# EAGLE board 63-00013_Battery_PCB_6.3 (EAGLE 9.6.2), part 1 of 2
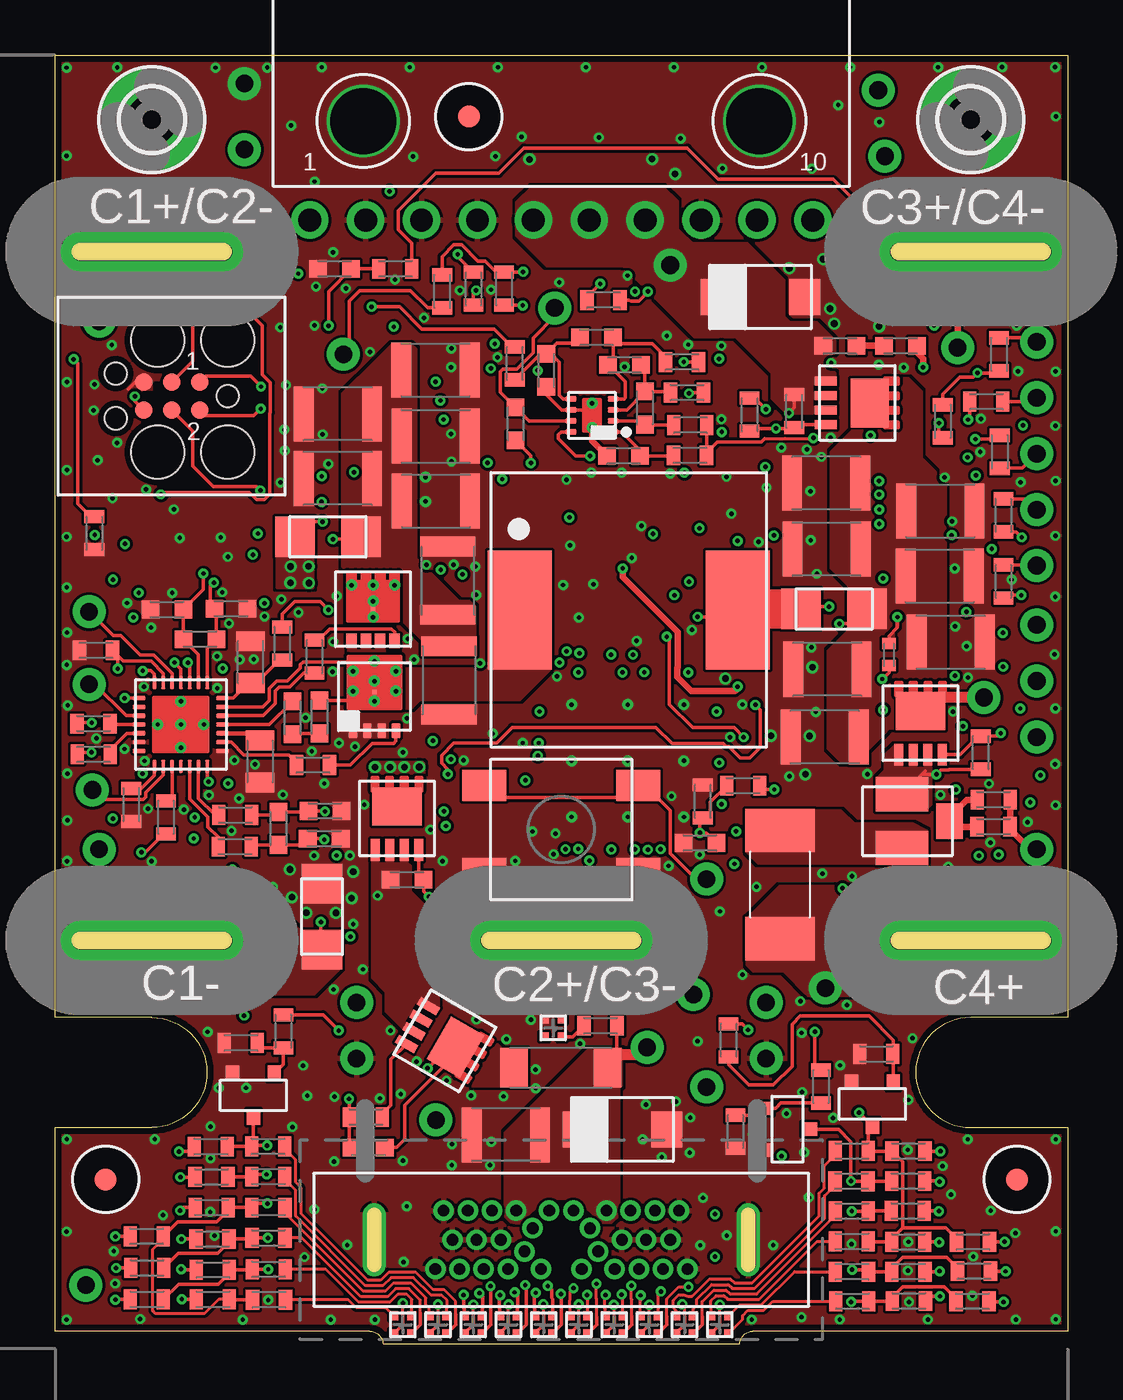
[diagram p8: board, top side]
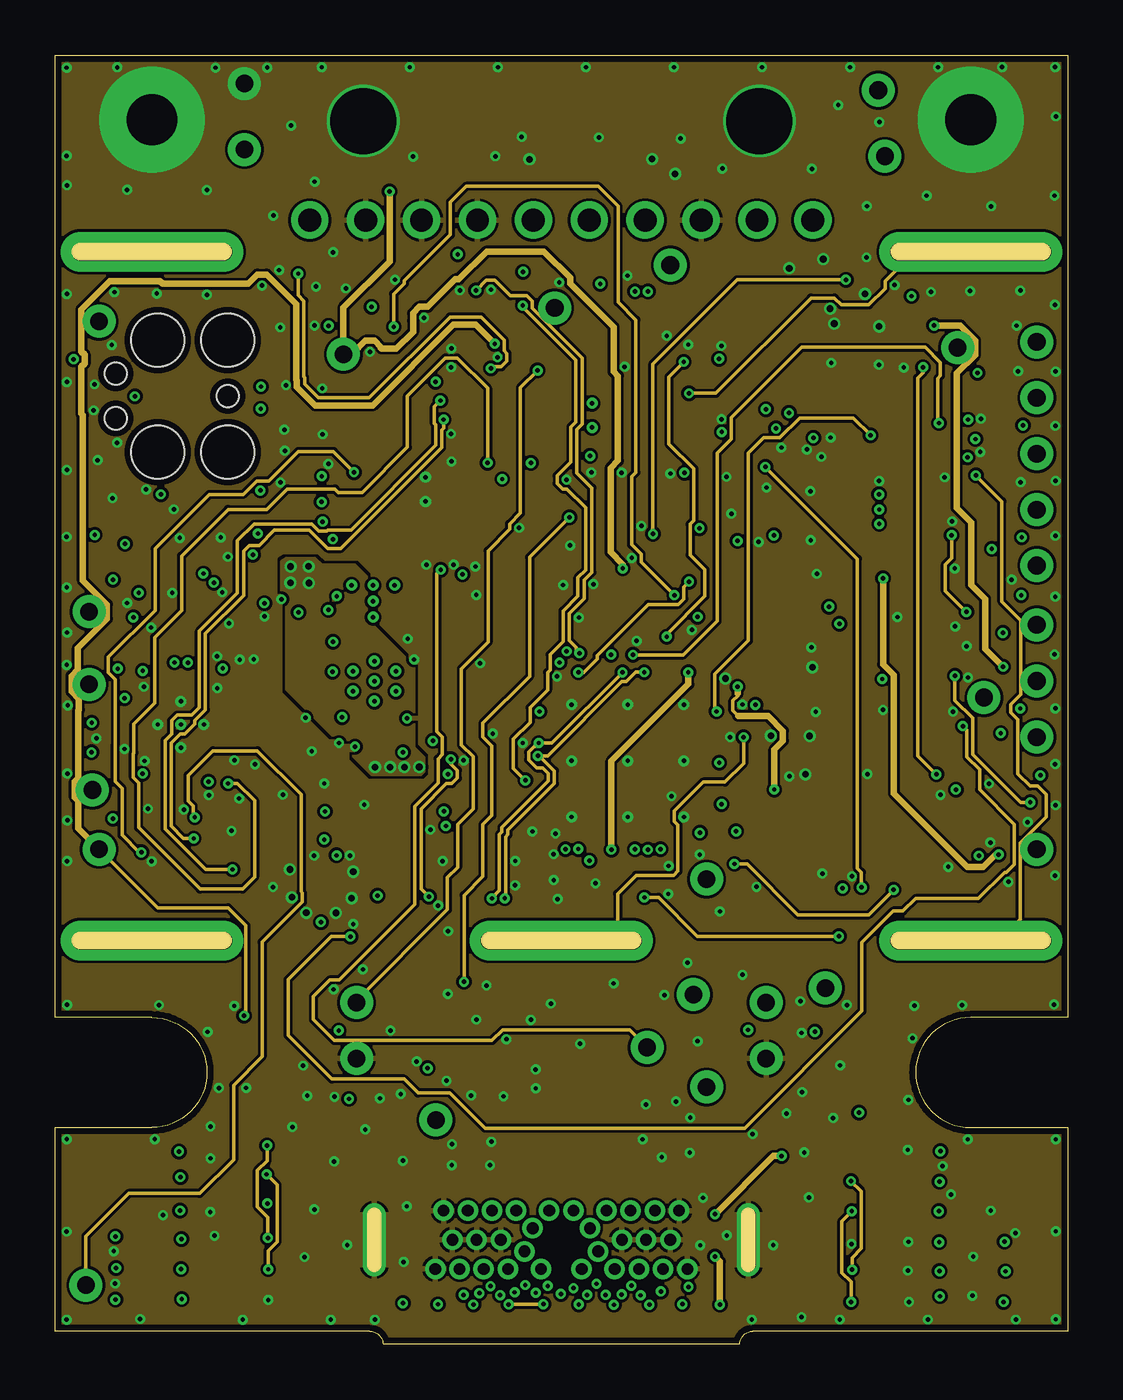
[diagram p9: board, inner layer Route2]
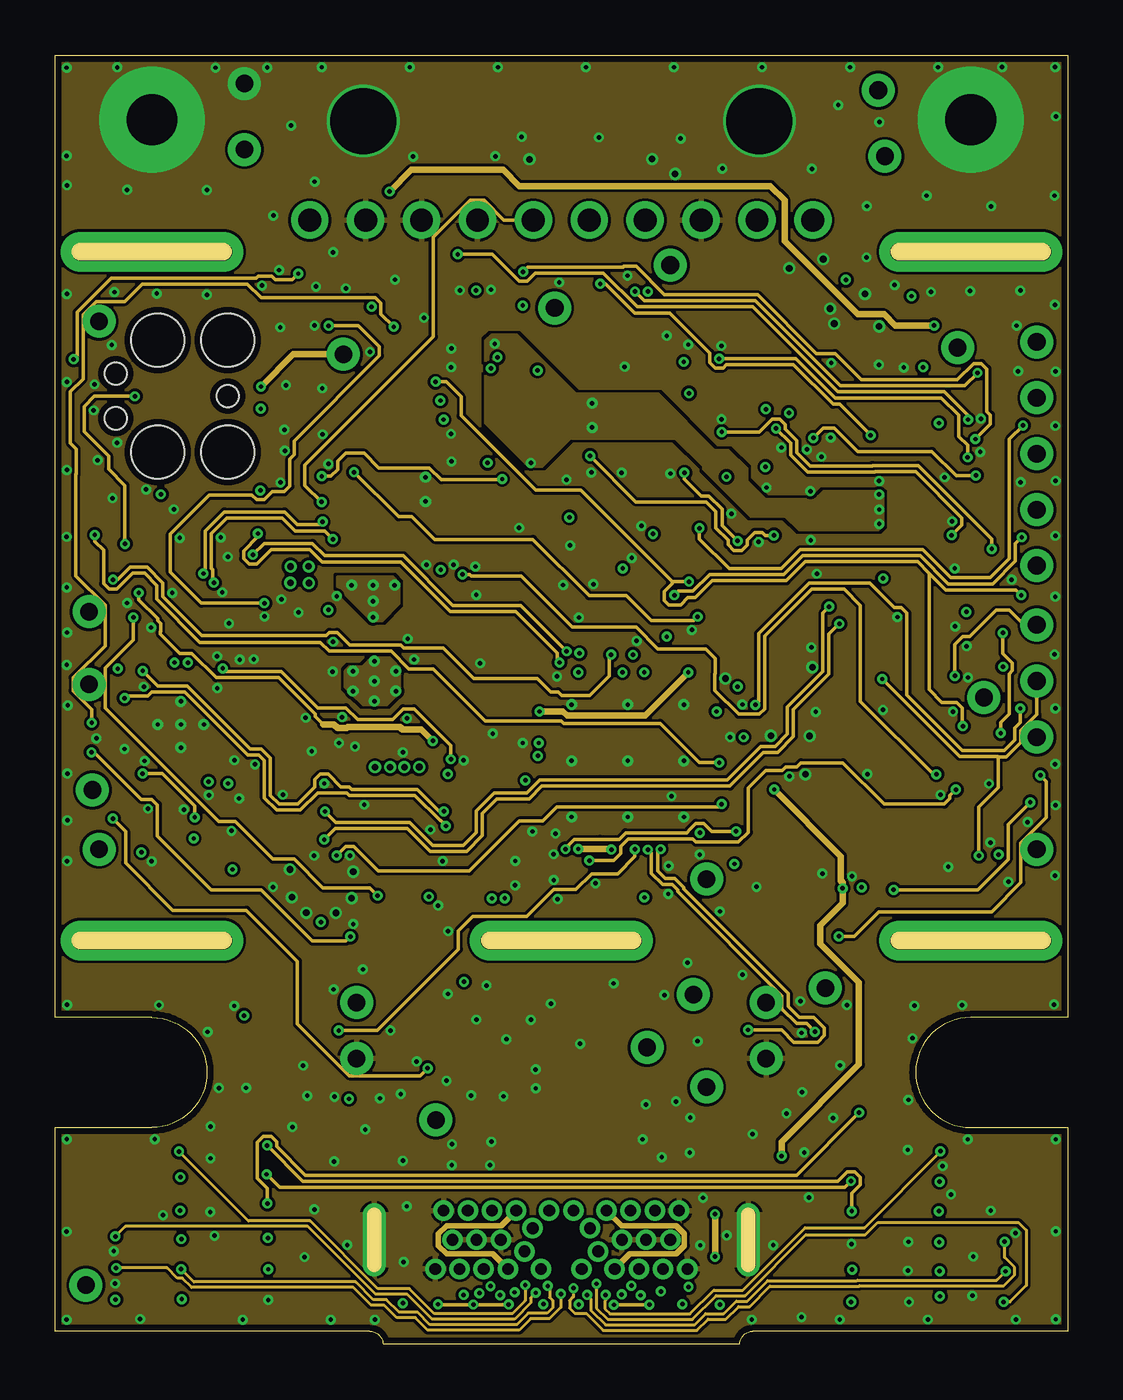
[diagram p10: board, inner layer Route15]
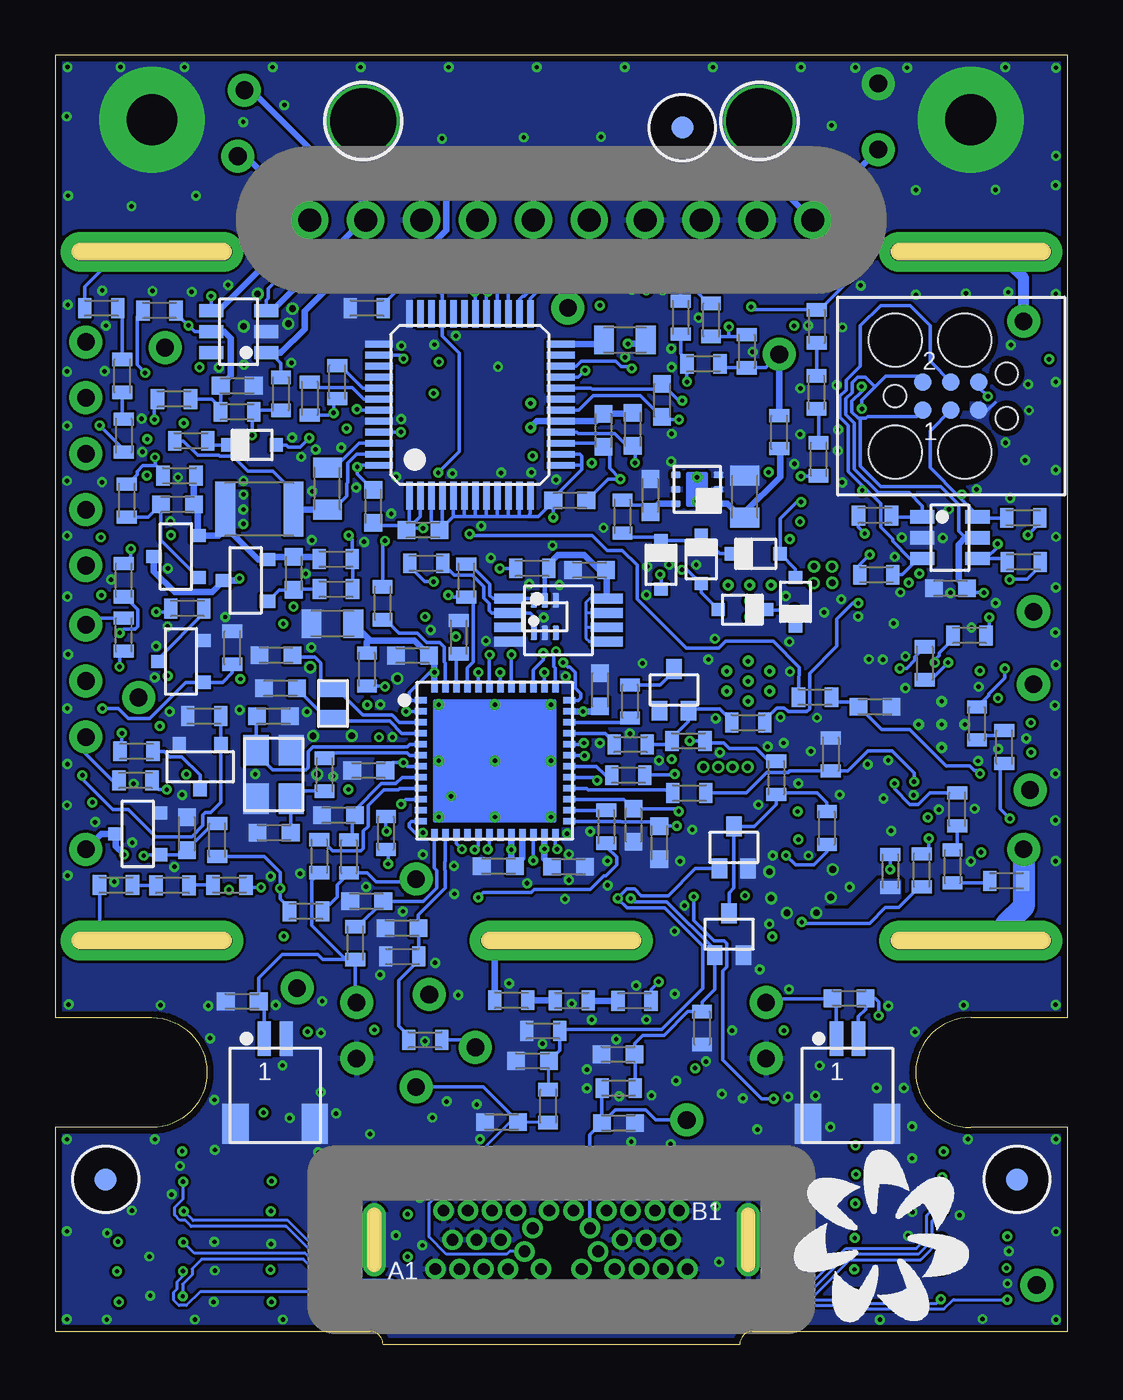
[diagram p11: board, bottom side, seen from below]

Size 46 x 58.6 mm. Coordinates in mm from the lower left corner, seen from the top.
Outline: 0,0.6 0,9.86 4.4,9.86 arc180 4.4,14.86 0,14.86 0,58.6 46,58.6 46,14.86 41.6,14.86 arc180 41.6,9.86 46,9.86 46,0.6 31.7,0.6 arc90 31.1,0 14.9,0 arc90 14.3,0.6 0,0.6
Copper layers (1+2*15+16): Top 0.035mm / dielectric 0.14mm / Route2 0.035mm / dielectric 1.2mm / Route15 0.035mm / dielectric 0.14mm / Bottom 0.035mm
Design rules "multi-cb_4L_035um-cu_125um_Strukturen": minimum track width 0.125mm, minimum drill 0.2mm, track to track 0.125mm, track to pad 0.125mm, pad to pad 0.125mm, via to via 0.125mm, smd to smd 0.125mm, copper to edge 0.3mm, drill to drill 0.2mm, minimum pad ring 0.125mm, minimum via ring 0.125mm, stop-mask expansion 0.05mm, vias tented up to drill 0.3mm, thermal gap 0.125mm
Net classes: 2 diff: width 0.125 mm
bRestrict: 5 lines

## Footprints (pad centres in the part's own frame; a part is rotated, then mirrored left to right if it is on the bottom)
C0603 = smd 0.8 x 0.8: 1 -0.75,0; 2 0.75,0
C1210 = smd 0.9 x 2.5: 1 -1.55,0; 2 1.55,0
C0805 = smd 0.9 x 1.3: 1 -0.95,0; 2 0.95,0
SMA_ST = smd 1.4 x 1.64: A 2.015,0; C -2.015,0
150044M155260_WUERTH = smd 0.4 x 0.4: 1 -0.4,-0.4; 2 -0.4,0.4; 3 0.4,0.4; 4 0.4,-0.4
SOD323F_SC-90_NXP = smd 0.6 x 0.6: A 1.1,0; C -1.1,0
SOT-323_DIODES_INC = smd 0.9 x 0.7: 1 0.95,-0.65; 2 0.95,0.65; 3 -0.95,0
0680L_BEL_FUSE = smd 1.96 x 3.15: 1 -2.455,0; 2 2.455,0
SFJ-XX12_DEXERIALS = smd 2.4 x 1.55: T1 0.25,1.225; T3 0.25,-1.225 | smd 1.2 x 1.6: T2 -1.9,0
2,3-PAD = drill 2.3 pad 4.8: B2,3 0,0
DSG0008A_WSON_TI = smd 0.5 x 0.25: 1 -0.95,0.75; 2 -0.95,0.25; 3 -0.95,-0.25; 4 -0.95,-0.75; 5 0.95,-0.75; 6 0.95,-0.25; 7 0.95,0.25; 8 0.95,0.75 | drill 0.2 pad 0.5: P$1 0,0.55; P$2 0,-0.55
S-PDSO-G8_DGK_VSSOP_TI = smd 0.45 x 1.45: 1 -0.975,-2.2; 2 -0.325,-2.2; 3 0.325,-2.2; 4 0.975,-2.2; 5 0.975,2.2; 6 0.325,2.2; 7 -0.325,2.2; 8 -0.975,2.2
DRL0006A_TI = smd 0.67 x 0.3: 1 -0.74,0.5; 2 -0.74,0; 3 -0.74,-0.5; 4 0.74,-0.5; 5 0.74,0; 6 0.74,0.5
SOT23-6L_WE = smd 0.6 x 1.1: 1 -0.95,-1.25; 2 0,-1.25; 3 0.95,-1.25; 4 0.95,1.25; 5 0,1.25; 6 -0.95,1.25
UFQFPN48_ST = smd 0.55 x 0.3: 1 -3.375,2.75; 2 -3.375,2.25; 3 -3.375,1.75; 4 -3.375,1.25; 5 -3.375,0.75; 6 -3.375,0.25; 7 -3.375,-0.25; 8 -3.375,-0.75; 9 -3.375,-1.25; 10 -3.375,-1.75; 11 -3.375,-2.25; 12 -3.375,-2.75; 25 3.375,-2.75; 26 3.375,-2.25; 27 3.375,-1.75; 28 3.375,-1.25; 29 3.375,-0.75; 30 3.375,-0.25; 31 3.375,0.25; 32 3.375,0.75; 33 3.375,1.25; 34 3.375,1.75; 35 3.375,2.25; 36 3.375,2.75 | smd 0.3 x 0.55: 13 -2.75,-3.375; 14 -2.25,-3.375; 15 -1.75,-3.375; 16 -1.25,-3.375; 17 -0.75,-3.375; 18 -0.25,-3.375; 19 0.25,-3.375; 20 0.75,-3.375; 21 1.25,-3.375; 22 1.75,-3.375; 23 2.25,-3.375; 24 2.75,-3.375; 37 2.75,3.375; 38 2.25,3.375; 39 1.75,3.375; 40 1.25,3.375; 41 0.75,3.375; 42 0.25,3.375; 43 -0.25,3.375; 44 -0.75,3.375; 45 -1.25,3.375; 46 -1.75,3.375; 47 -2.25,3.375; 48 -2.75,3.375 | drill 0.2 pad 0.5: EP1 -2.55,2.55; EP2 0,2.55; EP3 2.55,2.55; EP4 -2.55,0; EP5 0,0; EP6 2.55,0; EP7 -2.55,-2.55; EP8 0,-2.55; EP9 2.55,-2.55
DRV0006A_TI = smd 0.45 x 0.3: 1 -0.975,0.65; 2 -0.975,0; 3 -0.975,-0.65; 4 0.975,-0.65; 5 0.975,0; 6 0.975,0.65 | drill 0.2 pad 0.5: 7.1 0,0.55; 7.2 0,-0.55
RUY0028A_TI = smd 0.6 x 0.2: 1 -1.9,1.2; 2 -1.9,0.8; 3 -1.9,0.4; 4 -1.9,0; 5 -1.9,-0.4; 6 -1.9,-0.8; 7 -1.9,-1.2; 15 1.9,-1.2; 16 1.9,-0.8; 17 1.9,-0.4; 18 1.9,0; 19 1.9,0.4; 20 1.9,0.8; 21 1.9,1.2 | smd 0.2 x 0.6: 8 -1.2,-1.9; 9 -0.8,-1.9; 10 -0.4,-1.9; 11 0,-1.9; 12 0.4,-1.9; 13 0.8,-1.9; 14 1.2,-1.9; 22 1.2,1.9; 23 0.8,1.9; 24 0.4,1.9; 25 0,1.9; 26 -0.4,1.9; 27 -0.8,1.9; 28 -1.2,1.9 | drill 0.2 pad 0.5: E1 -1.05,0; E2 0,0; E3 0,1.05; E4 1.05,0; E5 0,-1.05
S-PQFP-G48_PFB_TI = smd 0.3 x 1.26: 1 -2.75,-4.13; 2 -2.25,-4.13; 3 -1.75,-4.13; 4 -1.25,-4.13; 5 -0.75,-4.13; 6 -0.25,-4.13; 7 0.25,-4.13; 8 0.75,-4.13; 9 1.25,-4.13; 10 1.75,-4.13; 11 2.25,-4.13; 12 2.75,-4.13; 25 2.75,4.13; 26 2.25,4.13; 27 1.75,4.13; 28 1.25,4.13; 29 0.75,4.13; 30 0.25,4.13; 31 -0.25,4.13; 32 -0.75,4.13; 33 -1.25,4.13; 34 -1.75,4.13; 35 -2.25,4.13; 36 -2.75,4.13 | smd 1.26 x 0.3: 13 4.13,-2.75; 14 4.13,-2.25; 15 4.13,-1.75; 16 4.13,-1.25; 17 4.13,-0.75; 18 4.13,-0.25; 19 4.13,0.25; 20 4.13,0.75; 21 4.13,1.25; 22 4.13,1.75; 23 4.13,2.25; 24 4.13,2.75; 37 -4.13,2.75; 38 -4.13,2.25; 39 -4.13,1.75; 40 -4.13,1.25; 41 -4.13,0.75; 42 -4.13,0.25; 43 -4.13,-0.25; 44 -4.13,-0.75; 45 -4.13,-1.25; 46 -4.13,-1.75; 47 -4.13,-2.25; 48 -4.13,-2.75
WE-PD_1260_WE = smd 2.9 x 5.4: DOT -4.95,0; NODOT 4.95,0
FERRIT_1806_WUERTH = smd 1.25 x 1.8: 1 -2.125,0; 2 2.125,0
PASSERMARKE = smd 1 x 1: P$1 0,0
R0402 = smd 0.5 x 0.6: 1 -0.5,0; 2 0.5,0
TSX-3225_SEIKO_EPSON = smd 1.4 x 1.15: 1 -1.1,-0.8; 2 1.1,-0.8; 3 1.1,0.8; 4 -1.1,0.8
ECX-12R_ECS = smd 0.8 x 1.3: 1 -0.7,0; 2 0.7,0
R0603 = smd 0.6 x 0.9: 1 -0.75,0; 2 0.75,0
LVT12_R003_OHMITE = smd 1.8 x 1.84: 1 -1.5,0; 2 1.5,0
430451025836_WUERTH = smd 2 x 1.4: 1 -3.5,2; 2 3.5,2; 3 -3.5,-2; 4 3.5,-2
702916000_WUERTH = drill 3 pad 3.3: P$1 0,0
POWERPAK_1212-8S_VISHAY = smd 0.99 x 0.405: 1 -1.435,0.993; 2 -1.435,0.331; 3 -1.435,-0.331; 4 -1.435,-0.993 | smd 1.725 x 2.235: 5 0.557,0
SOT-23_NXP = smd 0.6 x 0.7: 1 0.95,1; 2 -0.95,1; 3 0,-1
Q3A_TI = smd 0.7 x 0.4: 1 -1.55,0.975; 2 -1.55,0.325; 3 -1.55,-0.325; 4 -1.55,-0.975 | smd 0.2 x 0.2: 5 0.2,0 | drill 0.2 pad 0.5: P$1 -0.207,0; P$2 0.245,-0.975; P$3 0.245,0.975; P$4 0.698,0; P$5 1.603,0; P$6 1.15,0.975; P$7 1.15,-0.975
Q3_TI = smd 0.63 x 0.5: 1 -1.435,0.975; 2 -1.435,0.325; 3 -1.435,-0.325; 4 -1.435,-0.975 | smd 0.2 x 0.2: 5 0,0 | drill 0.2 pad 0.5: P$1 -0.36,0; P$4 0.365,0; P$5 1.09,0; P$6 1.09,0.975; P$7 1.09,-0.975
TESTVIA_ROUND_0.8MM = drill 0.8 pad 1.5: P$1 0,0
MUSBR-M5C1-XX_AMPHENOL = drill 0.53 pad 0.93: A1 -5.725,1.325; A2 -4.625,1.325; A3 -3.525,1.325; A4 -2.425,1.325; A5 -1.675,0.525; A6 -0.925,1.325; A7 0.925,1.325; A8 1.675,0.525; A9 2.425,1.325; A10 3.525,1.325; A11 4.625,1.325; A12 5.725,1.325; B1 5.35,-1.325; B2 4.25,-1.325; B3 3.15,-1.325; B4 2.05,-1.325; B5 1.3,-0.525; B6 0.55,-1.325; B7 -0.55,-1.325; B8 -1.3,-0.525; B9 -2.05,-1.325; B10 -3.15,-1.325; B11 -4.25,-1.325; B12 -5.35,-1.325; G1 -4.95,0; G2 -3.85,0; G3 -2.75,0; G4 2.75,0; G5 3.85,0; G6 4.95,0 | drill 0.65 pad 1.05: S1 8.5,1.125; S2 8.5,-1.125; S3 8.5,-0.975; S4 8.5,-0.825; S5 8.5,-0.675; S6 8.5,-0.525; S7 8.5,-0.375; S8 8.5,-0.225; S9 8.5,-0.075; S10 8.5,0.075; S11 8.5,0.225; S12 8.5,0.375; S13 8.5,0.525; S14 8.5,0.525; S15 8.5,0.675; S16 8.5,0.825; S17 8.5,0.975; S18 -8.5,1.125; S19 -8.5,-1.125; S20 -8.5,-0.975; S21 -8.5,-0.825; S22 -8.5,-0.675; S23 -8.5,-0.525; S24 -8.5,-0.375; S25 -8.5,-0.225; S26 -8.5,-0.075; S27 -8.5,0.075; S28 -8.5,0.225; S29 -8.5,0.375; S30 -8.5,0.525; S31 -8.5,0.525; S32 -8.5,0.675; S33 -8.5,0.825; S34 -8.5,0.975
665102131822_WURTH = smd 0.6 x 1.55: 1 -0.5,0; 2 0.5,0 | smd 1.2 x 1.8: S1 -1.8,-3.875; S2 1.8,-3.875
TC2030-IDC-FP_TAGCONNECT = smd 0.787 x 0.787: 1 -1.27,-0.635; 2 -1.27,0.635; 3 0,-0.635; 4 0,0.635; 5 1.27,-0.635; 6 1.27,0.635 | hole 2.4: 0.635,2.54; -2.54,2.54; 0.635,-2.54; -2.54,-2.54 | hole 1: -2.54,0; 2.54,1.016; 2.54,-1.016
WIREPAD_0.8X6.5MM = drill 0.8 pad 1.8: P$1 0,0; P$2 3.25,0; P$3 -3.25,0; P$4 -0.1,0; P$5 -0.2,0; P$6 -0.3,0; P$7 -0.4,0; P$8 -0.5,0; P$9 -0.6,0; P$10 -0.7,0; P$11 -0.8,0; P$12 -0.9,0; P$13 -1,0; P$14 -1.1,0; P$15 -1.2,0; P$16 -1.3,0; P$17 -1.4,0; P$18 -1.5,0; P$19 -1.6,0; P$20 -1.7,0; P$21 -1.8,0; P$22 -1.9,0; P$23 -2,0; P$24 -2.1,0; P$25 -2.2,0; P$26 -2.3,0; P$27 -2.4,0; P$28 -2.5,0; P$29 -2.6,0; P$30 -2.7,0; P$31 -2.8,0; P$32 -2.9,0; P$33 -3,0; P$34 -3.1,0; P$35 -3.2,0; P$36 0.1,0; P$37 0.2,0; P$38 0.3,0; P$39 0.4,0; P$40 0.5,0; P$41 0.6,0; P$42 0.7,0; P$43 0.8,0; P$44 0.9,0; P$45 1,0; P$46 1.1,0; P$47 1.2,0; P$48 1.3,0; P$49 1.4,0; P$50 1.5,0; P$51 1.6,0; P$52 1.7,0; P$53 1.8,0; P$54 1.9,0; P$55 2,0; P$56 2.1,0; P$57 2.2,0; P$58 2.3,0; P$59 2.4,0; P$60 2.5,0; P$61 2.6,0; P$62 2.7,0; P$63 2.8,0; P$64 2.9,0; P$65 3,0; P$66 3.1,0; P$67 3.2,0
SSW-110-03-G-S-RA-LL_SAMTEC = drill 1.04 pad 1.7: 1 -11.43,0; 2 -8.89,0; 3 -6.35,0; 4 -3.81,0; 5 -1.27,0; 6 1.27,0; 7 3.81,0; 8 6.35,0; 9 8.89,0; 10 11.43,0

## Placement (x,y rotation side)
C1  100n 50V  [C0603]  30.25,18.93 180 bottom
C2  100p 50V  [C0603]  19.72,23.59 270 bottom
C3  100n 50V  [C0603]  37.5,15.59 180 bottom
C4  100n 50V  [C0603]  31.84,20.15 180 bottom
C5  100p 50V  [C0603]  18.55,22.81 270 bottom
C6  100n 50V  [C0603]  22.68,21.72 0 bottom
C7  100n 50V  [C0603]  9.93,15.73 0 bottom
C8  100n 50V  [C0603]  21.71,35.19 180 bottom
C9  100n 50V  [C0603]  12.23,22.99 0 top
C10  100n 50V  [C0603]  29.76,31.31 180 bottom
C11  100n 50V  [C0603]  21.24,29.76 90 bottom
C12  100n 50V  [C0603]  25.86,21.74 180 bottom
C13  100n 50V  [C0603]  12.26,24.24 0 top
C14  100n 50V  [C0603]  10.8,28.48 90 top
C16  100n 50V  [C0603]  29.29,22.79 180 top
C17  100n 50V  [C0603]  6.58,32.05 0 top
C18  100n 50V  [C0603]  8,33.43 180 top
C19  4u7 25V  [C1210]  20.48,9.54 180 top
C20  4u7 25V  [C1210]  12.85,42.29 180 top
C21  100n 50V  [C0603]  5.33,34.37 180 bottom
C22  4u7 25V  [C1210]  12.85,39.36 180 top
C23  4u7 25V  [C1210]  17.29,44.28 0 top
C24  4u7 25V  [C1210]  17.3,38.33 0 top
C25  4u7 25V  [C1210]  17.85,34.71 90 top
C26  4u7 25V  [C1210]  17.29,41.27 0 top
C27  4u7 25V  [C1210]  17.9,30.18 270 top
C28  4u7 25V  [C1210]  35.05,36.14 180 top
C29  100n 50V  [C0603]  33.12,24.05 180 bottom
C30  4u7 25V  [C1210]  34.97,27.6 180 top
C31  4u7 25V  [C1210]  40.69,31.92 0 top
C32  4u7 25V  [C1210]  35.03,39.15 180 top
C33  4u7 25V  [C1210]  35.09,30.68 180 top
C34  4u7 25V  [C1210]  40.19,34.92 0 top
C35  4u7 25V  [C1210]  40.22,37.88 0 top
C36  100n 50V  [C0603]  10.15,23.45 270 top
C37  100n 50V  [C0603]  26.79,42.56 90 top
C38  100n 50V  [C0603]  5.08,33.4 0 top
C39  100n 50V  [C0603]  15.99,21.12 0 top
C40  100p 50V  [C0603]  14.23,8.95 0 top
C41  100n 50V  [C0603]  38.41,45.39 0 top
C42  100n 50V  [C0603]  25.88,44.51 180 top
C43  22u 10V  [C0805]  9.31,26.49 270 top
C44  1u 25V  [C0805]  8.88,31 90 top
C45  100n 50V  [C0603]  24.6,45.76 180 top
C46  100n 50V  [C0603]  22.32,44.26 270 top
C47  22u 10V  [C0805]  33.4,32.76 180 bottom
C48  100n 50V  [C0603]  31.75,26.09 180 bottom
C49  100n 50V  [C0603]  25.83,40.38 180 top
C50  100n 50V  [C0603]  12.01,28.52 90 top
C52  22u 10V  [C0805]  14.67,38.53 90 bottom
C53  100n 50V  [C0603]  18.95,38.58 90 bottom
C56  100n 50V  [C0603]  20.92,41.84 270 top
C59  100n 50V  [C0603]  35.16,35.04 90 bottom
C60  100n 50V  [C0603]  40.44,38.17 0 bottom
C61  100n 50V  [C0603]  35.65,45.37 0 top
C62  100n 50V  [C0603]  40.01,23.22 90 bottom
C63  100n 50V  [C0603]  37.72,43.57 0 bottom
C64  n.m.  [C0603]  8.75,28.98 0 bottom
C65  n.m.  [C0603]  12.7,48.88 180 top
C102  27p 50V  [C0603]  36.07,28.55 0 bottom
C103  27p 50V  [C0603]  36.04,23.27 180 bottom
C166  100n 50V  [C0603]  29.28,37.01 0 bottom
C167  100n 50V  [C0603]  22.62,38.36 0 bottom
C168  100n 50V  [C0603]  19.75,41.58 90 bottom
C169  100n 50V  [C0603]  21.09,41.54 90 bottom
C170  100n 50V  [C0603]  31.54,38.08 270 bottom
C171  4u7 25V  [C1210]  36.72,37.96 180 bottom
C173  1u 25V  [C0805]  33.63,38.9 90 bottom
C175  100n 50V  [C0603]  18.42,42.9 90 bottom
C177  22u 10V  [C0805]  20.11,45.66 0 bottom
C234  100p 50V  [C0603]  24.31,12.89 180 bottom
C235  100p 50V  [C0603]  20.42,13.18 180 bottom
C282  100p 50V  [C0603]  25.71,10.11 180 bottom
C283  100p 50V  [C0603]  20.41,10.06 0 bottom
C295  27p 50V  [C0603]  35.97,31.32 180 bottom
C296  27p 50V  [C0603]  35.76,29.82 180 bottom
D1  SMA6J20A  [SMA_ST]  25.77,9.77 0 top
D2  150044M155260  [150044M155260_WUERTH]  17.4,0.9 0 top
D3  150044M155260  [150044M155260_WUERTH]  19,0.9 0 top
D4  SMA6J20A  [SMA_ST]  32.05,47.6 0 top
D5  PMEG6010CEJ  [SOD323F_SC-90_NXP]  14.77,33.39 180 bottom
D6  n.m.  [SOD323F_SC-90_NXP]  14.17,35.94 0 bottom
D7  PMEG6010CEJ  [SOD323F_SC-90_NXP]  16.64,35.67 270 bottom
D8  PMEG6010CEJ  [SOD323F_SC-90_NXP]  12.36,33.75 90 bottom
D9  150044M155260  [150044M155260_WUERTH]  20.6,0.9 0 top
D10  PMEG6010CEJ  [SOD323F_SC-90_NXP]  37.05,40.88 0 bottom
D11  BAS70W-05  [SOT-323_DIODES_INC]  17.88,29.75 270 bottom
D12  150044M155260  [150044M155260_WUERTH]  15.8,0.9 0 top
D13  150044M155260  [150044M155260_WUERTH]  22.2,0.9 0 top
D14  150044M155260  [150044M155260_WUERTH]  23.8,0.9 0 top
D15  150044M155260  [150044M155260_WUERTH]  25.4,0.9 0 top
D16  150044M155260  [150044M155260_WUERTH]  27,0.9 0 top
D17  150044M155260  [150044M155260_WUERTH]  28.6,0.9 0 top
D18  150044M155260  [150044M155260_WUERTH]  30.2,0.9 0 top
D19  PMEG6010CEJ  [SOD323F_SC-90_NXP]  18.47,35.43 270 bottom
D20  150044M155260  [150044M155260_WUERTH]  22.63,14.39 90 top
F1  0680L9100-0  [0680L_BEL_FUSE]  32.93,20.9 90 top
F2  SFJ-1412  [SFJ-XX12_DEXERIALS]  38.73,23.78 180 top
H1  MOUNT-PAD-ROUND2.3  [2,3-PAD]  41.6,55.66 0 top
H2  MOUNT-PAD-ROUND2.3  [2,3-PAD]  4.4,55.66 0 top
IC1  BQ294703DSG  [DSG0008A_WSON_TI]  24.39,42.22 180 top
IC4  n.m.  [S-PDSO-G8_DGK_VSSOP_TI]  23.13,32.92 270 bottom
IC5  TMP112NAIDRL  [DRL0006A_TI]  23.75,33.08 90 bottom
IC6  824001  [SOT23-6L_WE]  5.35,36.66 270 bottom
IC8  STM32G431CBU6  [UFQFPN48_ST]  26.02,26.52 0 bottom
IC10  TPS70933DRV  [DRV0006A_TI]  16.83,38.86 180 bottom
IC11  BQ24780SRUY  [RUY0028A_TI]  5.72,28.17 270 top
IC14  824001  [SOT23-6L_WE]  37.66,46.03 90 bottom
IC26  BQ769X2PFB  [S-PQFP-G48_PFB_TI]  27.15,42.71 0 bottom
L2  744771004  [WE-PD_1260_WE]  26.07,33.38 0 top
L16  742792410  [FERRIT_1806_WUERTH]  22.97,12.58 0 top
PS1  PASSERMARKE  [PASSERMARKE]  17.5,55.3 0 bottom
PS2  PASSERMARKE  [PASSERMARKE]  2.3,7.5 0 bottom
PS3  PASSERMARKE  [PASSERMARKE]  43.7,7.5 0 bottom
PS4  PASSERMARKE  [PASSERMARKE]  18.8,55.8 0 top
PS5  PASSERMARKE  [PASSERMARKE]  43.7,7.5 0 top
PS6  PASSERMARKE  [PASSERMARKE]  2.3,7.5 0 top
PTC1  PRF15BE103RB6RC  [R0402]  37.89,31.35 270 top
Q1  TSX-3225_24.0000MF10Z-C  [TSX-3225_SEIKO_EPSON]  36.07,25.91 270 bottom
Q2  ECS-.327-12.5-12R  [ECX-12R_ECS]  33.37,29.13 270 bottom
R1  100k  [R0603]  29.18,13.84 0 bottom
R2  10k  [R0603]  30.22,17.63 0 bottom
R3  10R  [R0603]  10.93,23.47 270 bottom
R4  0R  [R0603]  11.72,26.34 0 top
R5  0R  [R0603]  11.79,31.26 90 top
R6  10R  [R0603]  5.04,23.95 270 top
R7  LVT12R0050FER  [LVT12_R003_OHMITE]  12.4,36.7 0 top
R8  100k  [R0603]  13.23,25.75 90 bottom
R9  1k  [R0603]  32.36,18.24 270 bottom
R10  1k  [R0603]  4.46,32.22 180 bottom
R11  10R  [R0603]  31.12,33.68 270 bottom
R12  10k  [R0603]  32.64,22.18 90 bottom
R13  10M  [R0603]  23.82,14.25 0 bottom
R14  10M  [R0603]  16.61,14.38 90 bottom
R15  1k  [R0603]  28.86,41.79 180 top
R16  10R  [R0603]  2,35.56 180 bottom
R17  1k  [R0603]  28.71,43.26 180 top
R18  0R  [R0603]  31.83,30.68 270 bottom
R19  10R  [R0603]  27.32,34.72 270 bottom
R20  1k  [R0603]  28.48,44.65 180 top
R21  1k  [R0603]  20.88,44.58 270 top
R22  1k  [R0603]  6.49,30.95 270 bottom
R23  10R  [R0603]  14.12,10.34 0 top
R24  510k  [R0603]  4.12,28.22 270 bottom
R25  150R  [R0603]  28.85,40.41 180 top
R26  100k  [R0603]  1.86,31.55 0 top
R27  0R  [R0603]  3.46,24.52 90 top
R28  510k  [R0603]  17.19,25.06 0 bottom
R29  0R  [R0603]  24.32,35.27 0 bottom
R30  1k  [R0603]  33.23,34.33 180 bottom
R34  10M  [R0603]  37.31,13.2 0 top
R35  10R  [R0603]  8.19,24.06 0 top
R36  10R  [R0603]  8.17,22.62 0 top
R37  LVT12R0050FER  [LVT12_R003_OHMITE]  35.39,33.43 0 top
R41  10R  [R0603]  10.32,31.86 90 top
R42  100k  [R0603]  10.76,26.81 270 bottom
R43  10M  [R0603]  42.05,26.89 270 top
R44  10R  [R0603]  1.75,26.82 0 top
R45  10R  [R0603]  1.75,28.21 0 top
R46  10R  [R0603]  30.6,13.82 90 top
R47  10R  [R0603]  34.8,11.72 90 top
R48  10M  [R0603]  33.24,35.69 0 bottom
R49  1k  [R0603]  42.74,38.36 90 bottom
R50  10M  [R0603]  40.35,39.48 180 bottom
R51  10R  [R0603]  43.09,34.68 90 top
R52  10R  [R0603]  43.08,37.68 90 top
R53  10R  [R0603]  42.92,40.57 270 top
R54  10M  [R0603]  38.63,22.93 270 bottom
R55  510k  [R0603]  37.73,42.38 180 bottom
R56  100k  [R0603]  24.78,14.49 0 top
R57  10R  [R0603]  10.38,14.23 90 top
R58  10R  [R0603]  42.31,42.85 0 top
R59  0R  [R0603]  24.92,47.47 180 top
R60  10R  [R0603]  35.74,43.2 90 bottom
R61  10R  [R0603]  11.47,29.42 180 bottom
R62  10R  [R0603]  15.46,48.88 0 top
R63  330R  [R0603]  9.69,6.22 0 top
R64  150R  [R0603]  9.69,7.63 0 top
R65  150R  [R0603]  9.68,9.01 0 top
R66  330R  [R0603]  7.12,6.22 180 top
R67  10R  [R0603]  2.02,37.57 180 bottom
R68  10R  [R0603]  8.69,34.98 0 bottom
R69  10R  [R0603]  8.75,37.68 0 bottom
R70  150R  [R0603]  7.11,7.61 180 top
R71  150R  [R0603]  7.15,4.79 180 top
R72  330R  [R0603]  7.17,2.05 180 top
R73  150R  [R0603]  4.17,2.05 180 top
R74  150R  [R0603]  7.08,9 180 top
R75  330R  [R0603]  9.72,2.04 0 top
R76  150R  [R0603]  9.71,3.42 0 top
R77  150R  [R0603]  9.7,4.85 0 top
R78  330R  [R0603]  4.16,4.92 180 top
R79  10M  [R0603]  33.58,42.42 90 top
R80  10k  [R0603]  42.88,34.73 270 bottom
R81  10k  [R0603]  31.55,42.26 90 top
R82  0R  [R0603]  13.11,41.46 90 bottom
R83  0R  [R0603]  20.22,37.63 90 bottom
R84  10k  [R0603]  42.29,26.96 180 bottom
R85  10k  [R0603]  39.99,33.45 180 bottom
R86  10M  [R0603]  39.23,28.56 0 bottom
R87  10M  [R0603]  37.95,31.66 270 bottom
R88  10M  [R0603]  30.91,9.67 90 top
R89  10M  [R0603]  8.44,13.71 0 top
R90  0R  [R0603]  14.51,28.26 0 bottom
R92  10R  [R0603]  29.14,35.5 180 bottom
R93  10k  [R0603]  16.54,44.56 0 bottom
R94  10k  [R0603]  14.57,45.14 270 bottom
R95  10R  [R0603]  42.89,45 90 top
R96  10k  [R0603]  17.59,47.86 270 top
R97  10k  [R0603]  40.59,42.97 0 bottom
R98  10k  [R0603]  41.25,46.99 0 bottom
R99  100k  [R0603]  33.99,22.19 270 bottom
R100  150R  [R0603]  7.17,3.4 180 top
R101  150R  [R0603]  4.18,3.48 180 top
R102  330R  [R0603]  41.7,4.67 0 top
R103  150R  [R0603]  41.75,3.33 0 top
R104  150R  [R0603]  41.68,1.96 0 top
R105  330R  [R0603]  38.77,8.78 0 top
R106  150R  [R0603]  38.77,3.31 0 top
R107  150R  [R0603]  38.79,1.98 0 top
R108  330R  [R0603]  38.76,4.66 0 top
R109  150R  [R0603]  38.76,7.43 0 top
R110  150R  [R0603]  38.74,6.07 0 top
R111  330R  [R0603]  36.2,8.8 180 top
R112  150R  [R0603]  36.18,7.42 180 top
R113  150R  [R0603]  36.2,6.07 180 top
R114  330R  [R0603]  36.2,4.68 180 top
R115  150R  [R0603]  36.2,3.31 180 top
R116  150R  [R0603]  36.22,1.96 180 top
R117  10R  [R0603]  20.95,23.53 90 bottom
R118  10R  [R0603]  19.95,25.87 180 bottom
R121  10R  [R0603]  19.88,29.22 270 bottom
R122  10R  [R0603]  19.85,27.27 180 bottom
R123  10k  [R0603]  17.22,27.43 0 bottom
R124  10M  [R0603]  31.26,25.39 0 top
R125  10M  [R0603]  29.42,24.68 270 top
R126  10R  [R0603]  43.23,20.88 0 bottom
R127  10R  [R0603]  40.66,20.86 0 bottom
R128  10R  [R0603]  38.08,20.88 0 bottom
R129  10R  [R0603]  43.9,47.1 0 bottom
R130  10R  [R0603]  42.95,44.02 270 bottom
R131  10R  [R0603]  42.87,41.3 270 bottom
R132  10R  [R0603]  25.27,15.65 0 bottom
R133  10R  [R0603]  22.53,15.63 0 bottom
R134  10R  [R0603]  19.67,15.62 0 bottom
R135  10R  [R0603]  11.39,46.27 270 bottom
R136  10R  [R0603]  11.41,43.27 270 bottom
R137  10R  [R0603]  11.31,40.22 270 bottom
R138  10R  [R0603]  2.79,21.07 180 bottom
R139  10R  [R0603]  5.23,21.72 90 bottom
R140  10R  [R0603]  5.02,24.32 90 bottom
R141  100k  [R0603]  2.88,27.15 270 bottom
R142  10R  [R0603]  40.33,41.95 270 top
R143  10R  [R0603]  19.01,47.98 270 top
R144  10R  [R0603]  20.4,47.98 270 top
R145  100k  [R0603]  27.66,32.14 270 bottom
R146  100k  [R0603]  42.88,32.26 90 bottom
R147  0R  [R0603]  42.64,23.53 180 top
R148  0R  [R0603]  42.64,24.76 180 top
R149  100k  [R0603]  34.6,19.69 180 bottom
R176  10R  [R0603]  42.34,25.64 0 bottom
R177  10R  [R0603]  30.97,23.24 90 bottom
R189  150R  [R0603]  39.82,41.06 180 bottom
R190  150R  [R0603]  6.63,21.55 90 bottom
R191  150R  [R0603]  8.06,21.51 90 bottom
R192  LVT12R0050FER  [LVT12_R003_OHMITE]  12.13,19.45 90 top
R217  10k  [R0603]  31.84,47.1 0 bottom
R218  10k  [R0603]  34.43,42.99 270 bottom
R227  10k  [R0603]  33.18,43.74 270 bottom
R228  330R  [R0603]  1.79,36.87 270 top
R229  10R  [R0603]  16.2,46.56 270 bottom
R232  10R  [R0603]  17.57,46.67 270 bottom
R296  330R  [R0603]  33.76,25.9 90 bottom
R322  10R  [R0603]  23.6,10.83 90 bottom
R337  10R  [R0603]  20.4,11.65 0 bottom
S1  430451025836  [430451025836_WUERTH]  23,23.4 0 top
SPACER1  n.m.  [702916000_WUERTH]  32,55.6 0 top
SPACER2  n.m.  [702916000_WUERTH]  14,55.6 0 top
T1  SISS06DN  [POWERPAK_1212-8S_VISHAY]  15.53,23.9 90 top
T2  DMG1012UW-7  [SOT-323_DIODES_INC]  15.16,22.59 270 bottom
T3  SISS06DN  [POWERPAK_1212-8S_VISHAY]  17.71,13.8 330 top
T4  PMV30ENEA  [SOT-23_NXP]  37.13,10.93 0 top
T5  PMV30ENEA  [SOT-23_NXP]  33.28,9.78 90 top
T6  PMV30ENEA  [SOT-23_NXP]  9.01,11.32 0 top
T7  DMG1012UW-7  [SOT-323_DIODES_INC]  15.38,18.65 270 bottom
T8  CSD17577Q3A  [Q3A_TI]  14.51,29.45 90 top
T9  CSD17308Q3  [Q3_TI]  14.45,33.42 90 top
T11  PMV30ENEA  [SOT-23_NXP]  37.34,34.72 270 bottom
T12  PMV30ENEA  [SOT-23_NXP]  40.51,35.81 270 bottom
T13  SISS06DN  [POWERPAK_1212-8S_VISHAY]  39.32,28.24 90 top
T14  SISS06DN  [POWERPAK_1212-8S_VISHAY]  36.45,42.79 0 top
T15  PMV30ENEA  [SOT-23_NXP]  42.24,23.21 270 bottom
T16  PMV30ENEA  [SOT-23_NXP]  39.41,26.26 0 bottom
T17  PMV30ENEA  [SOT-23_NXP]  40.28,31.04 270 bottom
TP1  TESTPOINT_VIA_ROUND_0.8MM  [TESTVIA_ROUND_0.8MM]  44.6,35.4 180 top
TP2  TESTPOINT_VIA_ROUND_0.8MM  [TESTVIA_ROUND_0.8MM]  44.6,37.94 180 top
TP3  TESTPOINT_VIA_ROUND_0.8MM  [TESTVIA_ROUND_0.8MM]  44.6,40.48 180 top
TP4  TESTPOINT_VIA_ROUND_0.8MM  [TESTVIA_ROUND_0.8MM]  44.6,43.02 180 top
TP5  TESTPOINT_VIA_ROUND_0.8MM  [TESTVIA_ROUND_0.8MM]  44.6,45.56 180 top
TP6  TESTPOINT_VIA_ROUND_0.8MM  [TESTVIA_ROUND_0.8MM]  13.7,13 0 top
TP7  TESTPOINT_VIA_ROUND_0.8MM  [TESTVIA_ROUND_0.8MM]  8.6,57.3 90 top
TP8  TESTPOINT_VIA_ROUND_0.8MM  [TESTVIA_ROUND_0.8MM]  26.9,13.5 90 top
TP9  TESTPOINT_VIA_ROUND_0.8MM  [TESTVIA_ROUND_0.8MM]  29.6,11.7 180 top
TP10  TESTPOINT_VIA_ROUND_0.8MM  [TESTVIA_ROUND_0.8MM]  17.3,10.2 180 top
TP11  TESTPOINT_VIA_ROUND_0.8MM  [TESTVIA_ROUND_0.8MM]  42.2,29.4 270 top
TP17  TESTPOINT_VIA_ROUND_0.8MM  [TESTVIA_ROUND_0.8MM]  13.1,45 270 top
TP18  TESTPOINT_VIA_ROUND_0.8MM  [TESTVIA_ROUND_0.8MM]  37.7,54 270 top
TP23  TESTPOINT_VIA_ROUND_0.8MM  [TESTVIA_ROUND_0.8MM]  32.3,15.54 0 top
TP24  TESTPOINT_VIA_ROUND_0.8MM  [TESTVIA_ROUND_0.8MM]  32.3,13 0 top
TP25  TESTPOINT_VIA_ROUND_0.8MM  [TESTVIA_ROUND_0.8MM]  35,16.2 0 top
TP26  TESTPOINT_VIA_ROUND_0.8MM  [TESTVIA_ROUND_0.8MM]  41,45.3 0 top
TP27  TESTPOINT_VIA_ROUND_0.8MM  [TESTVIA_ROUND_0.8MM]  29,15.9 0 top
TP28  TESTPOINT_VIA_ROUND_0.8MM  [TESTVIA_ROUND_0.8MM]  2,46.5 0 top
TP29  TESTPOINT_VIA_ROUND_0.8MM  [TESTVIA_ROUND_0.8MM]  2,22.5 0 top
TP30  TESTPOINT_VIA_ROUND_0.8MM  [TESTVIA_ROUND_0.8MM]  44.6,27.6 180 top
TP31  TESTPOINT_VIA_ROUND_0.8MM  [TESTVIA_ROUND_0.8MM]  44.6,32.7 180 top
TP32  TESTPOINT_VIA_ROUND_0.8MM  [TESTVIA_ROUND_0.8MM]  13.7,15.54 0 top
TP33  TESTPOINT_VIA_ROUND_0.8MM  [TESTVIA_ROUND_0.8MM]  8.6,54.3 0 top
TP34  TESTPOINT_VIA_ROUND_0.8MM  [TESTVIA_ROUND_0.8MM]  44.6,22.5 0 top
TP35  TESTPOINT_VIA_ROUND_0.8MM  [TESTVIA_ROUND_0.8MM]  44.6,30.15 0 top
TP36  TESTPOINT_VIA_ROUND_0.8MM  [TESTVIA_ROUND_0.8MM]  1.55,30 0 top
TP37  TESTPOINT_VIA_ROUND_0.8MM  [TESTVIA_ROUND_0.8MM]  1.7,25.2 0 top
TP38  TESTPOINT_VIA_ROUND_0.8MM  [TESTVIA_ROUND_0.8MM]  1.55,33.3 0 top
TP39  TESTPOINT_VIA_ROUND_0.8MM  [TESTVIA_ROUND_0.8MM]  22.7,47.1 270 top
TP40  TESTPOINT_VIA_ROUND_0.8MM  [TESTVIA_ROUND_0.8MM]  37.4,57 0 top
TP41  TESTPOINT_VIA_ROUND_0.8MM  [TESTVIA_ROUND_0.8MM]  29.6,21.15 0 top
TP42  TESTPOINT_VIA_ROUND_0.8MM  [TESTVIA_ROUND_0.8MM]  1.4,2.7 0 top
TP43  TESTPOINT_VIA_ROUND_0.8MM  [TESTVIA_ROUND_0.8MM]  27.95,49.05 0 bottom
X1  MUSBR-M5C1-M0  [MUSBR-M5C1-XX_AMPHENOL]  23,4.76 180 top
X2  665102131822  [665102131822_WURTH]  36,13.9 0 bottom
X6  TC2030-CTX  [TC2030-IDC-FP_TAGCONNECT]  5.3,43.1 180 top
X7  [WIREPAD_0.8X6.5MM]  41.6,18.36 180 bottom
X8  [WIREPAD_0.8X6.5MM]  41.6,49.66 180 bottom
X9  [WIREPAD_0.8X6.5MM]  23,18.36 180 bottom
X10  [WIREPAD_0.8X6.5MM]  4.4,49.66 180 bottom
X11  [WIREPAD_0.8X6.5MM]  4.4,18.36 180 bottom
X13  n.m.  [SSW-110-03-G-S-RA-LL_SAMTEC]  23,51.1 0 top
X14  665102131822  [665102131822_WURTH]  10,13.9 0 bottom
X21  TC2030-CTX  [TC2030-IDC-FP_TAGCONNECT]  5.3,43.1 0 bottom

## Tracks (layer width: path | path; a pad name or v marks a point on that pad's centre or on a via)
!HOST_PRESENT!_3V3  (via drill 0.2)
  Top 0.15: R59.2 24.17,47.6 v24.77,48.2
  Route2 0.15: v37.05,41.32 36.27,42.1 33.83,42.1 32.93,41.2 32.2,41.2 31.5,40.5 31.5,31.98 29.98,30.46 29.98,28.85 v30.05,28.77
  Route15 0.15: v24.77,48.2 25,48.2 26.33,46.88 27.93,46.88 29.75,45.06 29.75,44.62 30,44.37 30.35,44.37 30.5,44.52 33.55,44.52 35.34,42.73 35.64,42.73 v37.05,41.32
  Bottom 0.15: R60.1 36.91,42.45 R55.1 37.05,42.31 v37.05,41.32 | IC8.2 v30.05,28.78 v30.05,28.77
!LED_B  (via drill 0.2)
  Top 0.15: 7.93,4.79 8.89,4.79 R77.1 v9.67,4.85 v9.67,4.84 | 7.93,4.79 R71.1 | R65.1 8.93,9 R74.1 | R101.1 5.6,4.14 7.39,4.14 7.93,4.69 7.93,4.79 | R110.1 R113.1 36.94,6.06 v36.2,6.06 | R104.1 40.93,2.1 40.4,2.63 38.5,2.63 38.04,2.17 R107.1 38.02,1.96 R116.1 36.2,1.96 v36.16,1.93 | R65.1 8.97,9.04 v9.64,9.04 | R65.1 9.01,9.08 T6.3
  Route2 0.15: v36.16,1.93 36.16,2.85 35.75,3.26 35.75,5.61 v36.2,6.06 | v9.67,4.84 9.67,5.79 9.19,6.27 9.19,7.91 9.64,8.36 v9.64,9.04
  Route15 0.15: v36.2,6.06 36.2,6.86 36.58,7.25 36.58,7.6 36.34,7.85 35.98,7.85 35.56,7.42 11.26,7.42 v9.64,9.04
!LED_G  (via drill 0.2)
  Top 0.15: R70.1 8.93,7.61 R64.1 9.04,7.73 v9.61,7.73 | R73.1 5.61,2.75 7.42,2.75 7.92,3.24 R100.1 8.94,3.4 R76.1 v9.69,3.42 | R109.1 38,7.42 R112.1 v36.16,7.42 36.16,9.22 35.59,9.78 T5.3 | R115.1 R106.1 38.02,3.46 38.52,3.96 40.5,3.96 41,3.46 R103.1 | R115.1 | R115.1 36.86,3.4 v36.21,3.4 | v9.69,3.42
  Route2 0.15: v36.21,3.4 36.21,3.95 36.62,4.36 36.62,6.96 v36.16,7.42 | v9.69,3.42 9.69,4.26 10.09,4.67 10.09,7.25 v9.61,7.73
  Route15 0.15: v9.61,7.73 10.2,7.15 35.88,7.15 v36.16,7.42
!LED_R  (via drill 0.2)
  Top 0.125: R72.1 7.43,2.05 6.78,1.4 4.56,1.4 4.43,1.52 4.43,4.31 4.91,4.8 R78.1
  Top 0.15: R75.1 7.93,2.04 R72.1 | R63.1 R66.1 7.87,6.1 7.34,5.57 5.57,5.57 R78.1 | R63.1 | R114.1 36.97,4.66 R108.1 38.02,4.81 38.51,5.31 | 38.51,5.31 38.51,8.3 R105.1 36.96,8.79 R111.1 36.95,9.74 T4.3 v36.53,10.54 | R102.1 40.95,4.83 40.47,5.31 38.51,5.31 | R63.1 9.13,6.41 v9.65,6.41
  Route15 0.15: v9.65,6.41 9.65,7.1 9.19,7.55 9.19,9.2 9.46,9.47 9.81,9.47 10.06,9.22 10.06,9.01 11.37,7.7 33.69,7.7 v36.53,10.54
!UC_LED_B
  Top 0.15: T6.1 10.38,12.74 R57.1 9.42,13.48 R89.2
!UC_LED_G
  Top 0.15: R88.2 31.97,10.42 T5.1 32.74,10.73 32.97,10.97 R47.1
!UC_LED_R
  Top 0.15: T4.1 38.08,13.18 | 38.08,13.18 R34.2 | R46.1 30.6,12.71 31.52,11.79 32.64,11.79 33.49,12.64 33.49,14.55 33.87,14.92 36.98,14.92 38.08,13.83 38.08,13.18
+3V3  (via drill 0.2)
  Top 0.125: 30.2,1.3 v30.2,1.81 | 28.6,1.27 28.6,1.73 v28.5,1.83 | 27,1.31 v27,1.81 | 25.4,1.27 v25.4,1.79 v25.39,1.8 | 23.8,1.37 v23.8,1.81 v23.79,1.82 | 22.2,1.38 v22.2,1.82 v22.19,1.83 | 20.6,1.36 v20.6,1.81 v20.61,1.82 | 19,1.37 v19,1.81 v19,1.82 | 17.4,1.38 v17.4,1.82 v17.4,1.83 | 15.8,1.44 v15.8,1.88
  Top 0.15: D12.1 15.8,0.9 15.8,1.44 | D2.1 17.4,0.9 17.4,1.38 | D3.1 19,0.9 19,1.37 | D9.1 20.6,0.9 20.6,1.36 | D13.1 22.2,0.9 22.2,1.38 | D14.1 23.8,0.9 23.8,1.37 | D15.1 25.4,0.9 25.4,1.27 | D16.1 27,0.9 27,1.31 | D17.1 28.6,0.9 28.6,1.27 | D18.1 30.2,0.9 30.2,1.3 | R124.2 32.18,25.22 v32.67,25.22 | X6.1 6.84,44.01 8.88,44.01 v9.36,43.53 | R96.2 16.93,47.11 16.14,47.89 13.84,47.89 13.36,47.41 13.36,45.26 TP17.P$1
  Top 0.3: v31.01,29.9 31.01,29.81 30.89,29.69 28.91,29.69 28.27,30.33 28.27,30.75 28.29,30.77 28.29,32.37 25.79,34.88 v25.79,35.27
  Route2 0.15: v20.61,1.82 22.18,1.82 v22.19,1.83 | 31.01,29.58 31.01,29.47 30.8,29.26 30.8,28.8 31.03,28.57
  Route2 0.3: v30.2,1.81 30.2,3.77 v29.98,3.99 | v29.98,5.92 32.62,8.57 v33.01,8.57 | v32.67,25.22 32.67,27.04 33.07,27.44 33.07,27.89 32.39,28.57 31.03,28.57 | v43.07,30.8 42.25,31.61 42.25,33.88 41.62,34.52 41.62,37.36 40.96,38.02 40.96,40.52 40.97,40.54 40.97,44.14 41.8,44.97 41.8,45.63 41.13,46.3 v39.94,46.3 | v15.2,52.4 15.2,49.22 13.1,47.12 TP17.P$1 13.49,45 14.1,45.61 14.52,45.61 14.81,45.32 14.81,45.28 14.83,45.26 15.51,45.26 16.26,46.01 16.26,46.52 16.26,46.86 16.56,47.16 16.94,47.16 18.19,48.4 18.35,48.4 19.61,49.67 22.21,49.67 23.41,48.47 23.41,48.2 25.38,46.23 25.38,44.2 25.57,44.01 25.57,40.16 25.24,39.82 25.24,36 25.79,35.45 v25.79,35.27 | 31.01,29.58 v31.01,29.9
  Route15 0.15: v17.4,1.83 17.41,1.82 v19,1.82 v20.6,1.82 v20.61,1.82 | 25.37,1.82 v25.39,1.8 v26.99,1.8 v27,1.81 | 12.18,28.18 11.81,28.54 11.81,28.66 10.17,30.3 7.32,30.3 6.21,31.41 5.66,31.41 4.79,32.29 4.79,32.4 4.79,32.41 4.79,32.76 4.66,32.89 4.66,32.98 3.8,33.84 v3.8,34.16
  Route15 0.3: v9.36,43.53 10.83,45 TP17.P$1 | v32.67,25.22 35.7,22.19 35.7,21.07 35.78,21 v35.78,20.73 35.78,20.06 34.76,19.05 34.76,18.21 36.52,16.45 36.52,12.72 33.01,9.21 v33.01,8.57 | v29.98,3.99 v29.98,5.92 | v17.16,27.43 16.64,27.96 15.78,27.96 15.68,28.06 13.29,28.06 13.25,28.01 12.84,28.01 12.67,28.18 12.18,28.18 | v39.94,46.3 38.17,46.3 37.66,46.82 36.46,46.82 33.14,50.13 33.14,52 32.5,52.65 21.09,52.65 20.36,53.38 16.18,53.38 v15.2,52.4
  Bottom 0.15: v15.8,1.88 17.35,1.88 v17.4,1.83 | v27,1.81 27.02,1.83 v28.5,1.83 30.18,1.83 v30.2,1.81 | v25.39,1.8 23.81,1.8 v23.79,1.82 v22.2,1.82 v22.19,1.83 | R54.2 36.5,22.18 35.78,21.45 v35.78,20.73 35.78,20.24 35.35,19.81 R149.2 | R146.1 43.07,31.32 v43.07,30.8 | R18.2 31.04,29.93 v31.01,29.9 | R55.2 38.48,42.58 | 38.48,42.58 C63.1 | R97.2 38.87,42.97 38.48,42.58 | R93.2 15.61,44.39 R94.2 13.71,44.39 TP17.P$1 | R29.1 v25.79,35.27 | X21.1 6.86,42.18 9.09,42.18 9.17,42.1 9.34,42.1 | 9.34,42.1 9.52,42.1 9.8,42.37 9.8,42.86 9.36,43.3 v9.36,43.53 | IC6.5 4.64,36.66 4.95,36.98 4.95,38.16 5.77,38.98 8.49,38.98 9.41,39.91 9.41,42.03 9.34,42.1 | v17.16,27.43 R123.2 16.38,27.33 15.62,27.33 15.38,27.09 14.15,27.09 13.56,26.5 R8.2 | C21.1 4.37,34.16 v3.8,34.16 | IC14.5 39.66,46.03 v39.94,46.3 40.5,46.87 R98.2
  Bottom 0.3: IC14.5 38.31,46.03 38.02,45.74 38.02,44.02 C63.1 | R82.2 TP17.P$1 | C21.1 4.95,34.74 4.95,36.36 4.64,36.66
+VBAT  (via drill 0.2)  (1 unrouted)
  Top 0.125: 34.42,41.16 33.17,41.16 33.17,41.17 32.25,41.17 32.24,41.16
  Top 0.15: R25.1 29.6,40.51 | 29.6,40.51 29.6,41.78 R15.1 | 34.42,41.16 v34.45,41.2 | 32.24,41.16 32.08,41.01 30.09,41.01 29.6,40.51 | X7.P$59 X7.P$55 | X7.P$59 X7.P$60 | X7.P$59 X7.P$61
  Route2 0.15: X7.P$48 43.86,19.32 43.86,22.8 45.02,23.96 45.02,25 44.64,25.38 44.3,25.38 43.74,25.93 43.74,28.41 43.42,28.73 43.42,29.08 43.88,29.53 43.88,32.9 43.01,33.77 43.01,38.31 v41.83,39.49
  Route15 0.15: v34.45,41.2 34.89,41.64 35.41,41.64 36.46,40.59 39.84,40.59 40.93,39.49 v41.83,39.49
  Bottom 0.15: 43.62,18.36 43.62,18.92 43.98,19.27 R126.1 | 34.42,41.23 v34.45,41.2 34.86,40.79 35.41,40.79 35.5,40.88 D10.A
  pour Top (no thermals): 31.45,18.45 31.45,17.25 31.72,16.97 33.1,16.97 33.12,16.96 34.2,15.87 45.59,15.87 45.59,20.59 45.36,20.82 32.92,20.82 31.47,19.37
BQ769X2_ALERT  (via drill 0.2)
  Top 0.15: R53.1 42.75,41.14 v41.81,41.14 | v21.27,48.75 21.25,48.73 R144.1 20.04,48.73 19.54,49.23 19.21,49.23 18.47,49.97 18.12,49.97 17.59,49.44 R96.1
  Route15 0.15: v21.27,48.75 21.48,48.97 25.8,48.97 25.83,49 26.39,49 27.68,47.7 31.92,47.7 34.59,45.04 35.44,45.04 36.63,43.84 41,43.84 41.73,44.58 42.08,44.58 42.33,44.33 42.33,42.4 42.49,42.25 42.49,41.82 v41.81,41.14
  Bottom 0.15: IC26.25 24.4,47.53 23.18,48.75 v21.27,48.75
BQ769X2_CFETOFF/!CS  (via drill 0.2)
  Top 0.15: R95.1 42.79,44.15 v41.91,44.15 41.71,43.96 41.1,43.96 40.33,43.19 R142.1
  Route15 0.15: v41.91,44.15 41.32,43.57 35.67,43.57 31.81,47.43 26.76,47.43 26.51,47.68 26.51,47.69 v26.35,47.85
  Bottom 0.15: v41.91,44.15 42.28,44.52 42.28,46.72 R98.1 | IC26.29 26.4,47.79 v26.35,47.85
BQ769X2_CHG  (via drill 0.2)
  Route15 0.15: v30.29,41.47 31.99,41.47 32.58,42.05 32.93,42.05 33.18,41.8 33.18,41.59 33.7,41.07 33.7,40.53 34.32,39.91 37.12,39.91 37.15,39.95 39.21,39.95 42.55,36.6 v42.55,36.16
  Bottom 0.15: IC26.45 v30.29,41.46 v30.29,41.47 | v42.55,36.16 42.55,35.81 R80.1
BQ769X2_DSG  (via drill 0.2)
  Top 0.15: R81.2 31.79,43.01 v32.29,42.51
  Bottom 0.15: IC26.43 32.25,42.46 v32.29,42.51
BQ769X2_HDQ/MOSI  (via drill 0.2)
  Top 0.15: R58.1 41.56,42.1 v41.48,42.03 | R143.1 18.3,49.45 v18.3,49.55
  Route15 0.15: v41.48,42.03 41.48,42.21 40.4,43.29 35.55,43.29 31.69,47.16 26.44,47.16 24.9,48.69 21.81,48.69 21.44,48.32 21.09,48.32 19.87,49.55 v18.3,49.55
  Bottom 0.15: R97.1 41.48,42.83 v41.48,42.03 | v18.3,49.55 18.47,49.72 24.24,49.72 25.08,48.88 | 25.08,48.88 | 25.08,48.88 25.9,48.06 IC26.28
BQ769X2_NTC  (via drill 0.2)
  Route2 0.15: v21.92,44.26 21.14,43.48 21.14,37.78 20.66,37.29 20.66,37.05 19.67,36.06 19.67,31.92 18.46,30.71 18.46,27.25 18.99,26.72 18.99,24.33 18.28,23.62 18.28,21.69 17.83,21.23 17.83,19.77 13.7,15.64 TP32.P$1
  Bottom 0.15: X14.1 10.5,15.55 C7.1 10.7,15.71 13.53,15.71 TP32.P$1 | IC26.21 22.22,43.96 v21.92,44.26
CHARGER_VCC
  Bottom 0.15: R83.1 20.04,36.69 18.63,36.69 D19.C 16.88,36.53 D7.C 15.8,35.94 D6.C
COMMON_DRAIN  (via drill 0.2)
  Top 0.15: R37.2 36.22,32.75 v35.63,32.75 | R36.2 8.99,22.7 C36.2 11.19,22.7 C9.1 12.19,22.99 v12.23,22.95
  Top 0.5: TP11.P$1 39.92,29.4 T13.5
  Route15 0.15: v35.63,32.75 35.15,32.28 35.15,30.47 33.55,28.86 33.55,27.63 32.83,26.91 32.19,26.91 30.65,25.38 22.12,25.38 21.53,24.79 20.07,24.79 19.42,24.14 19.42,23.13 18.7,22.41 17.04,22.41 16.01,23.45 12.73,23.45 v12.23,22.95
  pour Top (no thermals): 36.86,26.41 36.86,27 37.65,27.78 37.87,28.01 38.43,28.01 39.62,28.01 40.35,28.73 40.35,29.99 40.45,30.08 40.45,39.19 39.36,40.28 39.36,43.3 38.85,43.81 38.76,43.9 38.2,43.9 37.76,43.9 37.45,43.58 36.23,42.37 36.23,41.87 36.23,41.53 35.87,41.17 35.26,40.56 35.26,39.22 35.26,35.28 35.99,34.55 36.09,34.45 36.09,33.81 36.09,32.47 35.76,32.15 35.12,31.5 35.12,30.41 35.12,27.09 35.66,26.56 35.77,26.44 36.79,26.44
EXT_UC_NRST_3V3  (via drill 0.2)
  Top 0.15: v4.8,38.64 4.88,38.71 8.83,38.71 9.15,38.39 9.51,38.39 9.75,38.64 9.75,42.33 9.78,42.36 9.78,43.71 9.41,44.08 9.41,46.3 8.5,47.22 7.19,47.22 6.27,46.29 6.27,44.7 X6.3
  Bottom 0.15: X21.3 6.25,41.52 6.25,39.85 4.91,38.51 | 4.91,38.51 4.1,37.7 IC6.6 4.05,37.57 R67.2 | v4.8,38.64 4.91,38.53 4.91,38.51
EXT_UC_SWCLK_3V3  (via drill 0.2)
  Top 0.15: X6.4 6.26,41.5 6.26,39.91 7.19,38.98 9.16,38.98 v9.33,38.81
  Bottom 0.15: X21.4 6.25,44.69 6.25,46.31 7.15,47.22 8.49,47.22 9.41,46.29 9.41,44.47 10.06,43.82 10.06,43.38 10.35,43.09 10.35,42.15 9.96,41.76 9.96,39.68 9.21,38.93 | 9.21,38.93 8.5,38.22 8.5,37.14 7.95,36.6 7.95,36.5 7.16,35.71 IC6.3 6.79,35.71 7.52,34.98 R68.2 | v9.33,38.81 9.21,38.93
EXT_UC_SWDIO_3V3  (via drill 0.2)
  Top 0.15: X6.2 6.83,42.2 9.03,42.2 v9.35,42.52
  Bottom 0.15: X21.2 6.84,44.01 8.26,44.01 8.71,43.56 | v9.35,42.52 9.35,42.92 8.71,43.56 | 8.71,43.56 8.79,43.56 9.18,43.96 9.54,43.96 9.78,43.71 9.78,43.27 10.07,42.98 10.07,42.26 9.69,41.88 9.69,39.79 8.61,38.71 7.2,38.71 6.6,38.11 IC6.1 7.94,37.61 R69.2
EXT_UC_SWO_3V3  (via drill 0.2)
  Top 0.15: X6.6 3.62,42.87 v3.62,43.09
  Route15 0.15: v3.62,43.09 1.79,43.09 1.33,42.63 1.33,41.48 2.44,40.38 2.44,39.78 3.18,39.04 v3.18,36.38
  Bottom 0.15: X21.6 4.03,43.49 v3.62,43.09 | v3.18,36.38 3.18,36.24 3.71,35.71 IC6.4 2.9,35.71 R16.2
GND  (via drill 0.2, 0.3)  (6 unrouted)
  Top 0.15: PTC1.1 37.89,32.2 38.27,32.58 v38.27,33.06 | X6.5 3.64,43.73 3.32,43.41 | X1.S12 X1.S10 | X1.S17 X1.S16 X1.S15 | X1.S17 X1.S14 | X1.S17 X1.S1 X1.S12 | X1.S15 X1.S12 | X1.S15 X1.S9 X1.S8 | X1.S15 X1.S10 | X1.S10 X1.S8 | X1.S8 X1.S7 X1.S4 | X1.S25 X1.S24 | X1.S25 X1.S23 | X1.S25 X1.S22 | X1.S25 X1.S26 X1.S31 | X1.S32 X1.S18 X1.S31 | X1.S33 X1.S31
  Bottom 0.15: X21.5 3.64,42.47 3.3,42.81
  other vias: 14.53,1.13 31.65,1.13 0.53,1.13 3.87,1.16 8.53,1.13 12.53,1.13 35.65,1.13 39.65,1.13 43.65,1.13 45.46,1.14 45.46,5.14 45.46,9.32 41.46,9.32 0.53,5.13 0.53,9.33 4.53,9.33 9.69,2.03 38.76,4.67 36.18,4.57 38.74,3.36 38.79,1.94 38.74,8.85 19.31,30.96 0.55,15.44 4.72,15.42 6.93,14.21 7.44,11.65 11.41,19.62 12.76,19.61 13.47,20.28 13.55,21.49 13.39,22.22 10.67,21.59 10.76,20.32 38.76,11.12 45.38,15.45 41.21,15.42 38.95,13.92 33.36,25.82 34.08,25.91 34.28,27.65 32.52,27.66 36.9,25.92 30.67,27.6 37.61,28.84 27.88,21.75 36.2,21.28 30.45,30.26 31.22,29.08 34.4,30.78 34.36,31.68 34.56,28.75 20.51,13.87 21.84,12.5 21.84,11.64 20.37,11.27 18.9,11.31 17.78,11.98 16.43,12.86 19.14,14.76 21.62,14.75 23.85,13.67 17.85,15.93 17.86,18.78 21.69,23.32 17.6,21.97 17.05,23.4 22.65,22.28 22.66,21.1 20.91,21.97 17.4,19.94 13.99,17.04 15.24,14.27 14.76,11.18 11.77,22.21 5.85,24.31 8.02,23.34 3.16,27.06 4.07,26.52 4.22,24.35 1.88,27.54 8.15,26.55 9.08,26.36 8.36,24.81 6.99,24.97 13.04,28.51 15.99,28.46 12.9,27.33 13.63,27.17 15.8,26.91 14.05,24.53 11.39,28.48 12.61,30.58 11.66,26.96 10.35,24.99 7.37,29.83 4.04,29.89 9.03,31.14 7.36,31.27 8.39,31.12 9.51,33.09 7.9,32.77 4.37,32.58 37.43,46.27 34.9,49.32 36.79,47.74 30.27,45.38 28.77,45.44 35.4,46.39 33.35,48.91 35.21,47.07 30.28,42.05 35.26,44.61 37.42,44.52 38.56,44.4 35.23,41.21 30.72,37.75 30.51,39.43 32.32,38.94 12.23,25.5 26.01,48.57 22.9,48.27 21.56,53.86 27.13,53.87 28.17,53.2 34.16,40.68 33,40.76 25.88,44.44 34.33,36.55 34.32,38.78 34.61,35.02 31.96,36.47 7.53,36.68 5.67,36.65 10.42,41.57 10.44,40.62 10.24,39.18 10.49,43.59 4.14,38.86 2.82,40.98 1.75,42.45 5.33,34.16 12.64,31.93 11.06,33.27 10.28,33.87 12.8,34 16.03,32.07 16.32,31.13 18.11,35.44 19.14,34.06 19.09,35.35 26.64,37.2 26.2,35.75 40.89,32.63 41.41,31.74 27.79,45.84 37.44,39.25 34.82,40.34 40.23,24.98 42.43,25.48 42.49,22.81 44.18,23.74 45.43,21.31 45.46,24.51 45.44,26.38 45.41,31.36 45.44,33.99 45.45,36.75 45.46,39.25 45.45,41.75 45.46,44.21 45.42,47.25 43.86,47.9 41.57,47.88 39.79,47.83 38.14,48.14 36.86,49.4 36.88,51.73 39.6,52.21 42.53,51.72 45.4,52.21 45.47,55.81 45.43,58.05 43.03,58.05 40.12,58.04 36.12,58.04 32.12,58.04 28.12,58.04 24.12,58.04 20.12,58.04 16.12,58.04 12.12,58.04 9.64,58.03 7.29,58.02 0.53,58.02 2.83,58.04 0.53,54.02 0.54,52.68 3.27,52.48 6.9,52.46 9.92,51.31 10.18,48.82 9.4,48.12 6.9,47.7 4.62,47.76 2.7,47.82 0.54,47.74 0.54,43.74 0.54,39.74 0.53,36.71 0.53,34.41 0.55,32.36 0.53,30.89 0.58,29.04 0.56,25.94 0.56,23.82 0.55,21.97 4.39,21.96 9.9,20.79 13.55,19.1 12.66,16.14 8.14,15.39 40.58,21.71 34.86,21.4 31.87,20.8 31.23,16.8 33.86,15.6 39.04,15.39 35.97,15.42 30.2,19.68 27.86,20.48 28.73,17.34 27.68,15.88 25.37,16.41 22.53,15.49 19.6,16.31 20.9,20.87 24.55,20.96 22.83,20.24 40.79,28.76 41.47,30.31 40.87,35.27 40.76,37.41 40.41,39.41 42.06,42.07 43.75,44.23 29.19,13.78 35.67,12.68 35.34,10.29 33.23,10.5 33.94,11.47 34.04,8.72 34.25,6.68 29.44,6.66 27.56,8.51 26.69,9.32 26.84,10.91 28.21,11.05 28.86,10.31 28.83,8.72 31.69,9.56 19.76,8.14 19.82,9.21 18.02,8.14 18.03,9.1 15.8,8.35 12.68,8.32 14.09,9.77 15.71,11.39 12.7,11.26 10.78,9.88 11.46,11.3 23.08,34.51 23.4,36.32 21.08,37.11 22.8,30.36 26.42,31.98 28.93,32.48 27.95,39.58 25.74,39.62 24.36,39.63 23.23,39.3 12.42,40.02 12.15,41.36 12.14,43.45 14.31,45.11 13.21,47.99 15.45,48.39 18.39,47.9 19.8,47.94 18.01,45.26 17.99,44.41 20.1,44.86 17.99,41.39 18.01,40.13 21.25,27.33 19.89,27.76 18.56,26.55 16.87,35.43 16.76,46.66 43.31,21.03 22.73,23.22 29.29,22.26 28.01,24.92 43.45,34.76 43.87,39.19 42.03,40.56 43.69,46.3 30.32,53.44 28.42,54.8 24.71,54.85 21.2,54.88 20.01,54 16.27,53.99 34.38,53.43 37.45,55.55 35.58,56.33 11.79,52.84 10.72,55.39 12.63,49.63 11.85,48.08 10.23,46.22 11.79,46.31 2.58,45.42 1.79,43.63 1.93,40.18 2.61,38.46 5.4,37.95 3.27,33.7 7.85,35.79 7.6,34.18 8.68,11.66 11.27,12.67 4.91,5.88 7.05,6.03 7.06,8.46 7.06,9.91 11.78,6.13 13.27,4.52 15.83,3.75 15.98,6.28 7.25,4.95 2.67,4.24 2.73,2.77 11.33,3.97 30.52,4.96 29.31,4.51 32.63,4.51 33.91,1.24 40.7,6.82 40.32,8.11 41.71,4 41.67,2.22 43.63,5.06 42.51,6.09 24.46,34.56 23.8,33.04 33.92,14.16 45.44,28.91
  pour Top (rank 6): 0.2,0.1 0.2,58.5 45.8,58.5 45.8,0.1
  pour Route2 (rank 6): 0.2,0.1 0.2,58.5 45.8,58.5 45.8,0.1
  pour Route15 (rank 6): 0.2,0.1 0.2,58.5 45.8,58.5 45.8,0.1
  pour Bottom (rank 6): 0.2,0.1 0.2,58.5 45.8,58.5 45.8,0.1
  pour Route2 (rank 5, no thermals): 13.1,0.6 13.1,6.9 32.6,6.9 32.6,0.6 32.9,0.6 32.9,12 31.1,12 31.1,14.1 33.5,14.1 33.5,12 33.2,12 33.2,0.6 45.8,0.6 45.8,58.5 29,58.5 29,52.5 30.8,52.5 30.8,49.8 28.1,49.8 28.1,58.5 20.6,58.5 20.6,49.8 12.8,49.8 12.8,52.2 16.7,52.2 16.7,58.5 0.2,58.5 0.2,0.6 12.2,0.6 12.2,8.1 13.1,8.1 13.1,11.7 12.5,11.7 12.5,14.1 14.9,14.1 14.9,11.7 13.4,11.7 13.4,7.8 12.5,7.8 12.5,0.6
  pour Top (rank 5, no thermals): 13.1,0.6 13.1,6.9 32.6,6.9 32.6,0.6 32.9,0.6 32.9,12 31.1,12 31.1,14.1 33.5,14.1 33.5,12 33.2,12 33.2,0.6 45.8,0.6 45.8,58.5 29,58.5 29,52.5 30.8,52.5 30.8,49.8 28.1,49.8 28.1,58.5 20.6,58.5 20.6,49.8 12.8,49.8 12.8,52.2 16.7,52.2 16.7,58.5 0.2,58.5 0.2,0.6 12.2,0.6 12.2,8.1 13.1,8.1 13.1,11.7 12.5,11.7 12.5,14.1 14.9,14.1 14.9,11.7 13.4,11.7 13.4,7.8 12.5,7.8 12.5,0.6
  pour Route15 (rank 5, no thermals): 13.1,0.6 13.1,6.9 32.6,6.9 32.6,0.6 32.9,0.6 32.9,12 31.1,12 31.1,14.1 33.5,14.1 33.5,12 33.2,12 33.2,0.6 45.8,0.6 45.8,58.5 29,58.5 29,52.5 30.8,52.5 30.8,49.8 28.1,49.8 28.1,58.5 20.6,58.5 20.6,49.8 12.8,49.8 12.8,52.2 16.7,52.2 16.7,58.5 0.2,58.5 0.2,0.6 12.2,0.6 12.2,8.1 13.1,8.1 13.1,11.7 12.5,11.7 12.5,14.1 14.9,14.1 14.9,11.7 13.4,11.7 13.4,7.8 12.5,7.8 12.5,0.6
  pour Bottom (rank 5, no thermals): 13.1,0.6 13.1,6.9 32.6,6.9 32.6,0.6 32.9,0.6 32.9,12 31.1,12 31.1,14.1 33.5,14.1 33.5,12 33.2,12 33.2,0.6 45.8,0.6 45.8,58.5 29,58.5 29,52.5 30.8,52.5 30.8,49.8 28.1,49.8 28.1,58.5 20.6,58.5 20.6,49.8 12.8,49.8 12.8,52.2 16.7,52.2 16.7,58.5 0.2,58.5 0.2,0.6 12.2,0.6 12.2,8.1 13.1,8.1 13.1,11.7 12.5,11.7 12.5,14.1 14.9,14.1 14.9,11.7 13.4,11.7 13.4,7.8 12.5,7.8 12.5,0.6
N$1  (via drill 0.2)
  Route2 0.15: v6.35,23.96 6.27,24.03 6.27,24.48 6.05,24.71 6.05,25.86 7.17,26.98 9.19,26.98 11.18,24.99 11.18,20.58 11.24,20.52 11.24,20.11 9.41,18.29 9.41,13.08 8.11,11.78 8.11,8.4 6.57,6.86 3.35,6.86 1.4,4.92 TP42.P$1
  Route15 0.15: v6.35,23.96 6.35,24.46 4.87,25.94 v3.98,25.94
  Bottom 0.15: R61.1 10.5,29.19 9.71,29.19 C64.1 9.47,28.98 8.44,27.95 7.18,27.95 5.52,26.28 4.43,26.28 4.24,26.09 4.13,26.09 v3.98,25.94
N$2  (via drill 0.2)
  Top 0.15: R41.2 10.32,33.19 10.88,33.76 12.04,33.76 v12.42,33.38
  Bottom 0.15: D8.C 12.36,33.33 v12.42,33.38 D5.C
N$3
  Top 0.15: TP41.P$1 29.1,21.15 27.94,22.31 27.94,24.26 26.81,25.4 26.58,25.4 | 26.58,25.4 S1.2 | S1.1 20.04,24.86 26.04,24.86 26.58,25.4
  Bottom 0.15: 32.52,21.43 R12.1 | R12.1 31.81,21.43 31.4,21.01 29.74,21.01 TP41.P$1 | R12.1 33.19,20.88 33.19,20.34 R149.1
N$4  (via drill 0.2)
  Top 0.15: R46.2 31.22,14.57 v31.49,14.3
  Route15 0.15: v27.51,22.51 27.37,22.37 27.37,21.53 27.72,21.18 28.15,21.18 28.56,20.77 28.56,20.7 33.3,15.95 33.3,15.37 33.81,14.86 34.47,14.86 34.95,14.39 34.95,14.04 34.65,13.74 33.57,13.74 33.01,14.3 v31.49,14.3
  Bottom 0.15: IC8.15 27.77,22.77 v27.51,22.51
N$5
  Bottom 0.15: IC8.47 28.27,30.97 28.31,31.01 28.31,31.7 28.52,31.91 29.11,31.91 29.54,32.34 30.39,32.34 30.98,32.94 R11.2
N$6  (via drill 0.2)
  Top 0.15: R57.2 12.18,14.98 v12.89,14.27
  Route15 0.15: v12.89,14.27 14.64,14.27 18.32,17.96 18.32,18.79 18.98,19.44 21.43,19.44 22.66,20.67 23.66,20.67 24.38,21.39 25.56,21.39 26.34,22.17 v26.34,22.5
  Bottom 0.15: IC8.18 26.27,22.58 v26.34,22.5
N$7
  Bottom 0.15: R121.1 18.5,29.97 17.88,30.59 D11.3
N$8
  Bottom 0.15: R296.1 34.93,25.15 Q1.3 35.29,24.78 C103.1
N$9
  Top 0.15: IC11.10 3.23,28.57 1.81,30 TP36.P$1
N$10
  Top 0.15: IC11.16 4.92,25.88 4.11,25.08 4.11,24.89 4,24.77 2.13,24.77 TP37.P$1
N$11
  Top 0.15: IC11.5 5.32,30.49 4.48,31.33 3.86,31.33 2.99,32.21 2.64,32.21 TP38.P$1
N$12
  Top 0.15: IC1.5 23.09,42.97 22.92,43.15 22.92,44.65 22.52,45.04 C46.1 | C45.2 23.61,45.51 22.79,45.51 C46.1 | C46.1 22.08,45.04 20.88,43.84 R21.2
N$13
  Top 0.15: IC1.4 25.85,42.97 25.9,43.02 25.9,43.75 25.14,44.51 C42.2 25.36,44.74 C45.1 25.62,45.49 27.12,45.49 27.73,44.88 R20.2
N$14
  Top 0.15: IC1.3 25.96,42.47 C37.2 | C37.2 27.92,43.31 R17.2 | C42.1 26.8,44.34 C37.2
N$15
  Top 0.15: IC1.2 26.63,41.97 C37.1 26.81,41.79 R15.2
N$16
  Top 0.15: IC1.1 25.74,41.47 26.58,40.63 C49.1 28.07,40.38 R25.2
N$17
  Top 0.15: IC1.7 21.54,41.97 C56.1 20.23,43.28 20.23,44.22 20.35,44.33 20.98,44.33 21.72,45.07 21.72,45.74 22.7,46.72 TP39.P$1
N$18  (via drill 0.2)
  Top 0.15: IC1.8 22.99,41.47 22.87,41.35 22.87,41.16 23.65,40.38 v24.31,40.38
  Route15 0.15: v32.66,36.77 32.26,36.77 32.14,36.9 31.78,36.9 31.44,36.55 31.44,36.34 31.19,36.09 30.83,36.09 30.58,36.35 30.58,36.56 30.02,37.11 30.02,37.85 29.58,38.29 26.39,38.29 v24.31,40.38
  Bottom 0.15: R30.1 R48.2 32.49,36.61 v32.66,36.77
N$19
  pour Top (no thermals): 39.58,21.89 31.95,21.89 31.45,22.39 31.45,24.01 31.68,24.24 35.7,24.24 36.3,23.65 38.97,23.65 39.58,23.33
N$20
  Bottom 0.15: R30.2 35.12,34.33 C59.1 35.82,34.29 T11.1
N$21
  Top 0.15: C14.2 9.74,28.17 IC11.25
N$22
  Bottom 0.15: R49.1 41.76,37.61 C60.1 41.2,36.55 T12.1
N$23
  Bottom 0.15: IC5.1 24.25,33.09 24.4,33.24 IC4.2 26.16,33.24 26.27,33.35 26.27,33.67 26.53,33.93 26.53,34.45 27.05,34.97 27.86,34.97 R92.1
N$24
  Top 0.15: IC11.17 5.32,24.98 R6.1
N$25  (via drill 0.2, 0.3)
  Top 0.15: IC11.2 6.52,31.36 C17.1 C38.2 | C38.2 | C38.2 6.74,34.31 v6.74,35.04 | R7.1 11.59,37.39 v12.16,37.39
  Route15 0.15: v6.74,35.04 6.83,35.13 6.83,36.97 7.03,37.17 | 7.03,37.17 | 7.03,37.17 7.69,37.83 10.43,37.83 10.99,37.27 12.03,37.27 v12.16,37.39
  other vias: 16.54,26.24 15.87,26.24 15.22,26.24 14.53,26.24 11.52,35.36 10.71,35.35 10.69,34.62 11.53,34.6
  pour Top (no thermals): 14.42,25.2 14.42,26.35 14.52,26.46 16.67,26.46 16.76,26.37 16.76,25.9 16.64,25.78 16.64,25.22 15.69,24.27 15.34,24.27
  pour Top (no thermals): 10.11,37.49 11.7,37.49 11.7,34.41 10.1,34.41 10.1,37.49
  pour Route2: 10.29,35.58 10.29,34.25 10.53,34.01 10.53,29.77 14.39,25.91 16.61,25.91 16.75,26.05 16.75,26.67 16.29,27.13 16.29,30.82 14.14,32.97 14.14,34.89 13.62,35.41 12.11,35.41 11.8,35.73 10.53,35.73
N$26  (via drill 0.2)
  Top 0.15: R37.1 33.99,33.53 v35.16,33.53 | R35.2 10.01,24.06 C36.1 11.47,24.2 C13.1 12.24,24.25 v12.26,24.23 | R6.2 4.94,23.2 4.1,22.37 v3.93,22.37 | L2.NODOT 30.7,33.07 v29.19,33.07
  Top 1.8: R37.1 31.02,33.43 L2.NODOT
  Route2 0.15: v13.58,39.64 12.64,40.58 11.06,40.58 10.08,39.6 10.06,39.6 9.7,39.24 9.15,39.24 8.55,38.63 7.01,38.63 4.55,36.17 4.55,33.36 2.42,31.24 2.42,30.54 2.73,30.23 2.73,27.24 2.73,25.58 3.05,25.26 3.05,23.15 3.84,22.37 v3.93,22.37
  Route15 0.15: v35.16,33.53 34.88,33.24 34.88,30.58 33.27,28.97 33.27,27.75 32.71,27.19 32.07,27.19 30.55,25.66 22.02,25.66 21.42,25.07 19.95,25.07 19.14,24.25 19.14,23.28 18.55,22.69 17.16,22.69 16.12,23.72 12.76,23.72 v12.26,24.23 | v29.19,33.07 29.02,32.9 27.08,32.9 25.95,34.03 24.26,34.03 21.71,36.58 17.25,36.58 16.21,37.62 15.6,37.62 v13.58,39.64
N$27  (via drill 0.2)
  Top 0.15: IC11.1 6.92,31.64 C17.2 7.33,33.36 C18.2 7.05,33.63 7.05,34.46 v7.22,34.62 | R7.2 13.79,36.6 v12.62,36.6
  Route15 0.15: v12.62,36.6 12.25,36.97 10.9,36.97 10.32,37.55 7.8,37.55 7.1,36.86 7.1,35.27 7.16,35.21 7.16,34.68 v7.22,34.62
  pour Top (no thermals): 13.3,32.91 15.8,32.91 16.59,32.12 16.75,31.96 16.75,31.38 18.46,31.38 19.06,31.98 19.06,33.52 18.81,33.77 18.33,33.77 16.46,35.64 16.38,35.72 16.38,36.64 16.38,45.22 16.16,45.45 15.32,45.45 14.59,44.72 13.08,43.21 13.08,35.68 13.08,35.35 13.29,35.14 13.3,35.12 13.3,33.71
  pour Route15 (no thermals): 12.84,34.87 15.33,34.87 15.62,34.58 15.62,33.67 14.86,32.91 14.38,32.91 14.17,33.13 12.84,34.45 12.84,34.85
N$28  (via drill 0.2)
  Top 0.15: IC11.4 5.72,30.7 5.61,30.81 5.61,30.82 v5.43,30.99
  Bottom 0.15: v5.43,30.99 5.61,30.82 5.61,30.81 6.21,30.2 R22.2
N$29  (via drill 0.2)
  Top 0.15: IC11.3 6.12,30.9 v6.03,30.99
  Bottom 0.15: v6.03,30.99 6.03,31.13 5.84,31.32 5.84,31.42 5.2,32.05 R10.2
N$30  (via drill 0.2)
  Route15 0.15: v3.56,33.04 3.56,32.02 2.27,30.74 2.27,28.93 7.43,23.77 8.19,23.77 9.9,22.06 10.87,22.06 12.17,20.76 14.29,20.76 v14.66,20.39
  Bottom 0.15: R10.1 3.56,32.37 v3.56,33.04
  pour Top (no thermals): 15.99,22.89 15.99,21.89 16.13,21.75 16.13,20.58 17.42,19.3 17.42,15.35 16.4,14.33 15.85,14.33 15.04,15.14 15.04,16.03 14.42,16.65 14.42,22.86
N$31  (via drill 0.2)
  Top 0.15: T1.4 16.53,21.34 C39.2 16.74,20.59 v16.98,20.35 | C40.1 13.37,9.06 R23.1 13.37,11.15 v13.35,11.16
  Route2 0.15: v16.98,20.35 16.63,20.71 16.63,24.35 17.77,25.49 18.02,25.49 18.27,25.74 18.27,26.09 17.98,26.39 v17.98,26.6
  Route15 0.15: v7.62,30.73 7.77,30.58 10.28,30.58 11.92,28.94 13.22,28.94 13.75,28.41 15.34,28.41 15.81,28.88 16.32,28.88 17.98,27.22 v17.98,26.6
  Bottom 0.15: v13.35,11.16 13.9,11.16 15.66,12.92 15.66,16.98 15.48,17.16 15.48,18.23 15.6,18.35 16.04,18.35 16.98,19.28 16.98,20.12 v16.98,20.35 | R22.1 6.94,31.25 6.94,31.1 7.31,30.73 v7.62,30.73
N$32  (via drill 0.2)
  Route15 0.15: v41.46,40.32 41.46,40.86 41.06,41.26 41.06,42.23 40.27,43.02 35.44,43.02 33.66,44.8 v30.17,44.8
  Bottom 0.15: IC26.38 30.45,44.96 30.33,44.96 v30.17,44.8 | 42.71,39.08 R49.2 42.71,39.11 42.27,39.54 42.27,39.67 42.01,39.94 41.39,39.94 | 41.39,39.94 41.46,40 v41.46,40.32 | R50.2 41.1,39.64 41.39,39.94
N$33
  Bottom 0.125: IC4.8 21.72,33.89 21.88,33.73 21.88,33.24 | 21.88,33.24 21.88,32.59 | 21.88,32.59 21.88,32.09 21.74,31.94 IC4.5 | IC4.6 21.88,32.59 | 21.88,32.59 | IC4.7 21.88,33.24
  Bottom 0.2: IC5.5 23.75,35.09 R29.2
  Bottom 0.3: IC4.8 20.93,35.16 C8.1 21.27,35.19 21.95,35.87 23.16,35.87 23.57,35.45 R29.2
N$34  (via drill 0.2)
  Top 0.15: PTC1.2 37.89,30.55 v37.58,30.24
  Route15 0.15: v37.58,30.24 41.1,26.73 42.83,26.73 42.85,26.7 | v41.97,22.21 41.97,24.42 42.85,25.31 42.85,26.7 | 42.85,26.7 43.22,26.7 43.88,27.36 43.88,27.9 44.6,28.62 TP35.P$1